# Altium project ESP32_P4_M3.PrjPcb
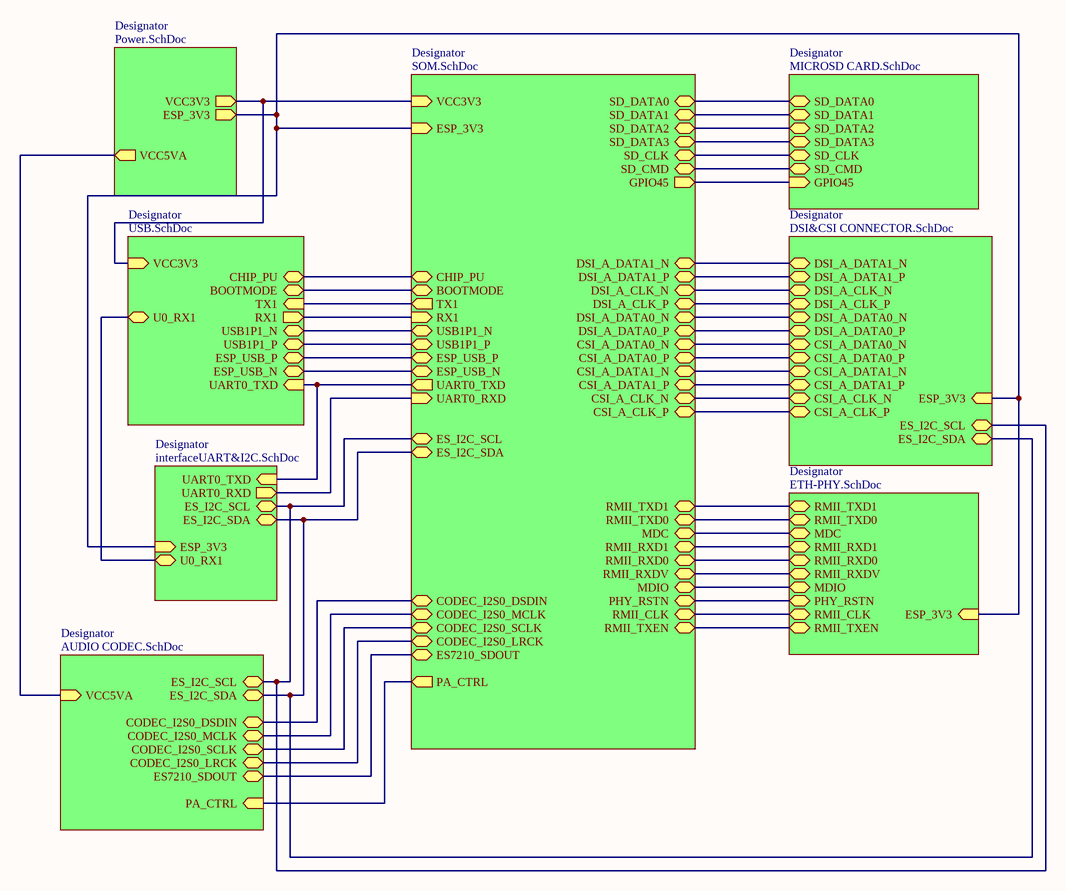
[diagram p0: Main.SchDoc]
9 sheets, 203 parts. Net scope: hierarchical (ports join the sheet entries above them; power ports are global).
Board file: ESP32P4 SOM.PcbDoc
Sheets:
  Main.SchDoc
    Designator = Power.SchDoc
    Designator = interfaceUART&I2C.SchDoc
    Designator = AUDIO CODEC.SchDoc
    Designator = MICROSD CARD.SchDoc
    Designator = USB.SchDoc
    Designator = DSI&CSI CONNECTOR.SchDoc
    Designator = ETH-PHY.SchDoc
    Designator = SOM.SchDoc

## Sheet Main.SchDoc
size A4; Author: Qquoc; CompanyName: VKU; DrawnBy: Qquoc; Address1: AN NHƠN-BÌNH ĐỊNH; Revision: V1.0; SheetNumber: 1; SheetTotal: 9

### Sub-sheets
Designator = Power.SchDoc: VCC3V3 (out), ESP_3V3 (out), VCC5VA (out)
Designator = interfaceUART&I2C.SchDoc: ESP_3V3 (in), UART0_TXD (in), UART0_RXD (out), ES_I2C_SCL (bidir), ES_I2C_SDA (bidir), U0_RX1 (bidir)
Designator = AUDIO CODEC.SchDoc: VCC5VA (in), PA_CTRL (in), CODEC_I2S0_SCLK (bidir), ES7210_SDOUT (bidir), CODEC_I2S0_LRCK (bidir), CODEC_I2S0_DSDIN (bidir), ES_I2C_SDA (bidir), ES_I2C_SCL (bidir), CODEC_I2S0_MCLK (bidir)
Designator = MICROSD CARD.SchDoc: GPIO45 (in), SD_DATA2 (bidir), SD_DATA3 (bidir), SD_CLK (bidir), SD_DATA0 (bidir), SD_DATA1 (bidir), SD_CMD (bidir)
Designator = USB.SchDoc: VCC3V3 (in), CHIP_PU (bidir), BOOTMODE (bidir), RX1 (out), TX1 (in), USB1P1_N (bidir), USB1P1_P (bidir), ESP_USB_P (bidir), ESP_USB_N (bidir), U0_RX1 (bidir), UART0_TXD (in)
Designator = DSI&CSI CONNECTOR.SchDoc: ES_I2C_SCL (bidir), ES_I2C_SDA (bidir), DSI_A_DATA1_N (bidir), DSI_A_DATA1_P (bidir), DSI_A_CLK_N (bidir), DSI_A_CLK_P (bidir), DSI_A_DATA0_N (bidir), DSI_A_DATA0_P (bidir), ESP_3V3 (in), CSI_A_DATA0_N (bidir), CSI_A_DATA0_P (bidir), CSI_A_DATA1_N (bidir), CSI_A_DATA1_P (bidir), CSI_A_CLK_N (bidir), CSI_A_CLK_P (bidir)
Designator = ETH-PHY.SchDoc: ESP_3V3 (in), RMII_TXEN (bidir), RMII_TXD0 (bidir), RMII_CLK (bidir), RMII_RXDV (bidir), RMII_RXD0 (bidir), RMII_RXD1 (bidir), MDC (bidir), PHY_RSTN (bidir), MDIO (bidir), RMII_TXD1 (bidir)
Designator = SOM.SchDoc: VCC3V3 (in), CHIP_PU (bidir), SD_DATA2 (bidir), SD_DATA3 (bidir), SD_CLK (bidir), SD_CMD (bidir), GPIO45 (out), SD_DATA1 (bidir), SD_DATA0 (bidir), UART0_RXD (in), UART0_TXD (out), BOOTMODE (bidir), RX1 (in), TX1 (out), USB1P1_P (bidir), USB1P1_N (bidir), ESP_USB_P (bidir), ESP_USB_N (bidir), CSI_A_DATA1_P (bidir), CSI_A_DATA1_N (bidir), CSI_A_CLK_N (bidir), CSI_A_CLK_P (bidir), CSI_A_DATA0_P (bidir), CSI_A_DATA0_N (bidir), DSI_A_DATA0_P (bidir), DSI_A_CLK_P (bidir), DSI_A_CLK_N (bidir), DSI_A_DATA1_P (bidir), DSI_A_DATA1_N (bidir), PA_CTRL (out), RMII_TXD1 (bidir), RMII_TXD0 (bidir), MDC (bidir), RMII_RXD1 (bidir), RMII_RXD0 (bidir), RMII_RXDV (bidir), MDIO (bidir), PHY_RSTN (bidir), RMII_CLK (bidir), RMII_TXEN (bidir), ES7210_SDOUT (bidir), CODEC_I2S0_DSDIN (bidir), CODEC_I2S0_MCLK (bidir), CODEC_I2S0_SCLK (bidir), CODEC_I2S0_LRCK (bidir), ES_I2C_SDA (bidir), ES_I2C_SCL (bidir), ESP_3V3 (in), DSI_A_DATA0_N (bidir)

### Nets
ESP_3V3: sheet Designator/ESP_3V3, sheet Designator/ESP_3V3, sheet Designator/ESP_3V3, sheet Designator/ESP_3V3, sheet Designator/ESP_3V3
VCC3V3: sheet Designator/VCC3V3, sheet Designator/VCC3V3, sheet Designator/VCC3V3
BOOTMODE: sheet Designator/BOOTMODE, sheet Designator/BOOTMODE
CHIP_PU: sheet Designator/CHIP_PU, sheet Designator/CHIP_PU
CODEC_I2S0_DSDIN: sheet Designator/CODEC_I2S0_DSDIN, sheet Designator/CODEC_I2S0_DSDIN
CODEC_I2S0_LRCK: sheet Designator/CODEC_I2S0_LRCK, sheet Designator/CODEC_I2S0_LRCK
CODEC_I2S0_MCLK: sheet Designator/CODEC_I2S0_MCLK, sheet Designator/CODEC_I2S0_MCLK
CODEC_I2S0_SCLK: sheet Designator/CODEC_I2S0_SCLK, sheet Designator/CODEC_I2S0_SCLK
CSI_A_CLK_N: sheet Designator/CSI_A_CLK_N, sheet Designator/CSI_A_CLK_N
CSI_A_CLK_P: sheet Designator/CSI_A_CLK_P, sheet Designator/CSI_A_CLK_P
CSI_A_DATA0_N: sheet Designator/CSI_A_DATA0_N, sheet Designator/CSI_A_DATA0_N
CSI_A_DATA0_P: sheet Designator/CSI_A_DATA0_P, sheet Designator/CSI_A_DATA0_P
CSI_A_DATA1_N: sheet Designator/CSI_A_DATA1_N, sheet Designator/CSI_A_DATA1_N
CSI_A_DATA1_P: sheet Designator/CSI_A_DATA1_P, sheet Designator/CSI_A_DATA1_P
DSI_A_CLK_N: sheet Designator/DSI_A_CLK_N, sheet Designator/DSI_A_CLK_N
DSI_A_CLK_P: sheet Designator/DSI_A_CLK_P, sheet Designator/DSI_A_CLK_P
DSI_A_DATA0_N: sheet Designator/DSI_A_DATA0_N, sheet Designator/DSI_A_DATA0_N
DSI_A_DATA0_P: sheet Designator/DSI_A_DATA0_P, sheet Designator/DSI_A_DATA0_P
DSI_A_DATA1_N: sheet Designator/DSI_A_DATA1_N, sheet Designator/DSI_A_DATA1_N
DSI_A_DATA1_P: sheet Designator/DSI_A_DATA1_P, sheet Designator/DSI_A_DATA1_P
ES7210_SDOUT: sheet Designator/ES7210_SDOUT, sheet Designator/ES7210_SDOUT
ES_I2C_SCL: sheet Designator/ES_I2C_SCL, sheet Designator/ES_I2C_SCL, sheet Designator/ES_I2C_SCL, sheet Designator/ES_I2C_SCL
ES_I2C_SDA: sheet Designator/ES_I2C_SDA, sheet Designator/ES_I2C_SDA, sheet Designator/ES_I2C_SDA, sheet Designator/ES_I2C_SDA
ESP_USB_N: sheet Designator/ESP_USB_N, sheet Designator/ESP_USB_N
ESP_USB_P: sheet Designator/ESP_USB_P, sheet Designator/ESP_USB_P
GPIO26: sheet Designator/TX1, sheet Designator/TX1
GPIO27: sheet Designator/RX1, sheet Designator/RX1
GPIO28: sheet Designator/RMII_RXDV, sheet Designator/RMII_RXDV
GPIO29: sheet Designator/RMII_RXD0, sheet Designator/RMII_RXD0
GPIO30: sheet Designator/RMII_RXD1, sheet Designator/RMII_RXD1
GPIO31: sheet Designator/MDC, sheet Designator/MDC
GPIO34: sheet Designator/RMII_TXD0, sheet Designator/RMII_TXD0
GPIO37: sheet Designator/UART0_TXD, sheet Designator/UART0_TXD, sheet Designator/UART0_TXD
GPIO38: sheet Designator/UART0_RXD, sheet Designator/UART0_RXD
GPIO45: sheet Designator/GPIO45, sheet Designator/GPIO45
GPIO50: sheet Designator/RMII_CLK, sheet Designator/RMII_CLK
GPIO51: sheet Designator/PHY_RSTN, sheet Designator/PHY_RSTN
GPIO52: sheet Designator/MDIO, sheet Designator/MDIO
RMII_TXD1: sheet Designator/RMII_TXD1, sheet Designator/RMII_TXD1
RMII_TXEN: sheet Designator/RMII_TXEN, sheet Designator/RMII_TXEN
SD_CLK: sheet Designator/SD_CLK, sheet Designator/SD_CLK
SD_CMD: sheet Designator/SD_CMD, sheet Designator/SD_CMD
SD_DATA0: sheet Designator/SD_DATA0, sheet Designator/SD_DATA0
SD_DATA1: sheet Designator/SD_DATA1, sheet Designator/SD_DATA1
SD_DATA2: sheet Designator/SD_DATA2, sheet Designator/SD_DATA2
SD_DATA3: sheet Designator/SD_DATA3, sheet Designator/SD_DATA3
U0_RX1: sheet Designator/U0_RX1, sheet Designator/U0_RX1
USB1P1_N: sheet Designator/USB1P1_N, sheet Designator/USB1P1_N
USB1P1_P: sheet Designator/USB1P1_P, sheet Designator/USB1P1_P
VCC5VA: sheet Designator/VCC5VA, sheet Designator/VCC5VA
NetIC2_1: sheet Designator/PA_CTRL, sheet Designator/PA_CTRL

## Sheet Power.SchDoc
size A4; SheetNumber: 5; SheetTotal: 9
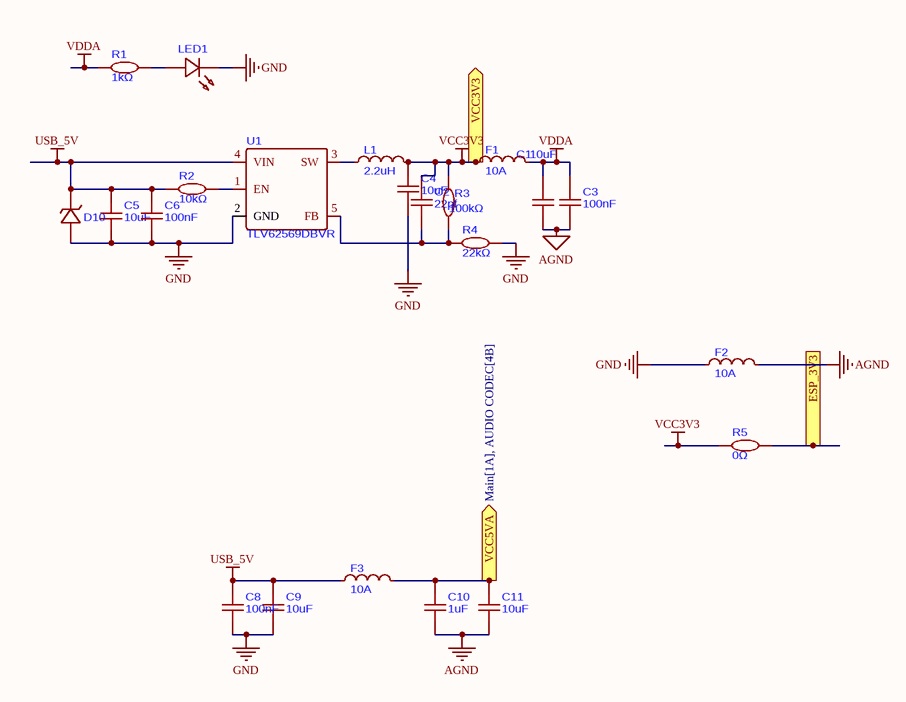
[diagram p1: Power.SchDoc]

### Parts
C1  10uF  [C0603]
C2  22pf  [C0603]
C3  100nF  [C0603]
C4  10uF  [C0603]
C5  10uF  [C0603]
C6  100nF  [C0603]
C8  100nF  [C0603]
C9  10uF  [C0603]
C10  1uF  [C0603]
C11  10uF  [C0603]
D10  DIODE ZENER 5.6V 500mW LL-34  [LL-34_L3.5-W1.5-RD]  (value not drawn)
F1  10A  [IND-SMD_L8.5-W3.1]
F2  10A  [IND-SMD_L8.5-W3.1]
F3  10A  [IND-SMD_L8.5-W3.1]
L1  2.2uH  [IND-SMD_L5.4-W5.2]
LED1  XL-1608SURC-06  [LED0603-RD_RED]  (value not drawn)
R1  1kΩ  [R0603]
R2  10kΩ  [R0603]
R3  100kΩ  [R0603]
R4  22kΩ  [R0603]
R5  0Ω  [R0603]
U1  TLV62569DBVR  [SOT-23-5_L3.0-W1.7-P0.95-LS2.8-BR]

### Ports
ESP_3V3 (out, see Main[2A], DSI&CSI CONNECTOR[3C], ETH-PHY[2A], interfaceUART&I2C[1C], SOM[6B]), VCC3V3 (out, see Main[2A], SOM[4A], USB[4C]), VCC5VA (out, see Main[1A], AUDIO CODEC[4B])

### Nets
AGND: C1.1 C3.1 C10.2 C11.1 F2.2
ESP_3V3: R5.2 ; port ESP_3V3
GND: C4.1 C5.1 C6.1 C8.1 C9.1 D10.2(A) F2.1 LED1.1(K) R4.2 U1.2(GND)
USB_5V: C5.2 C6.2 C8.2 C9.2 D10.1(K) F3.1 R2.1 U1.4(VIN)
VCC3V3: C2.2 C4.2 F1.1 L1.2 R3.2 R5.1 ; port VCC3V3
VDDA: C1.2 C3.2 F1.2 R1.2
VCC5VA: C10.1 C11.2 F3.2 ; port VCC5VA
NetC2_1: C2.1 R3.1 R4.1 U1.5(FB)
NetL1_1: L1.1 U1.3(SW)
NetLED1_2: LED1.2(A) R1.1
NetR2_2: R2.2 U1.1(EN)

### Library data of the parts
C1 C4 C5 C9 C11 = CL10A106MA8NRNC: 25V 10uF X5R ±20% 0603 Ceramic Capacitors ROHS
C2 = CL10C220JB8NNNC: 50V 22pF C0G ±5% 0603 Ceramic Capacitors RoHS
C3 C6 C8 = CC0603KRX7R9BB104: 50V 100nF X7R ±10% 0603 Ceramic Capacitors ROHS
C10 = CL10B105KA8NNNC: 25V 1uF X7R ±10% 0603 Ceramic Capacitors ROHS
D10 = ZMM5V6_C707195: Zener Diode Independent 5.6V 500mW Surface Mount LL-34
F1-F3 = HI3312X101R-10: 4mΩ 100Ω@100MHz SMD,8.5x3.1mm Ferrite Beads and Chips ROHS
L1 = APH0530T2R2M: 7A 2.2uH Molded Inductor ±20% 7A 29mΩ SMD,5.4x5.2mm Fixed Inductors RoHS
LED1 = XL-1608SURC-06: 20mA 2.3V Red 50mW 0603 LED Indication - Discrete ROHS
R1 = RMC 0603 1K J N: 100mW 1kΩ 50V ±100ppm/℃ Thick Film Resistor ±5% 0603 Chip Resistor - Surface Mount ROHS
R2 = RC0603FR-0710KL: 100mW 10kΩ 75V ±100ppm/℃ Thick Film Resistor ±1% 0603 Chip Resistor - Surface Mount ROHS
R3 = RC0603FR-07100KL: 100mW 100kΩ 75V ±100ppm/℃ Thick Film Resistor ±1% 0603 Chip Resistor - Surface Mount ROHS
R4 = RC0603FR-0722KL: 100mW 22kΩ 75V ±100ppm/℃ Thick Film Resistor ±1% 0603 Chip Resistor - Surface Mount RoHS
R5 = RC0603JR-070RL: 100mW 0Ω 75V Thick Film Resistor ±5% 0603 Chip Resistor - Surface Mount RoHS
U1 = TLV62569DBVR: 1.5MHz 2A Buck Adjustable 600mV~5.5V 1 SOT-23-5 Voltage Regulators - DC DC Switching Regulators RoHS

## Sheet interfaceUART&I2C.SchDoc
size A; SheetNumber: 3; SheetTotal: 9
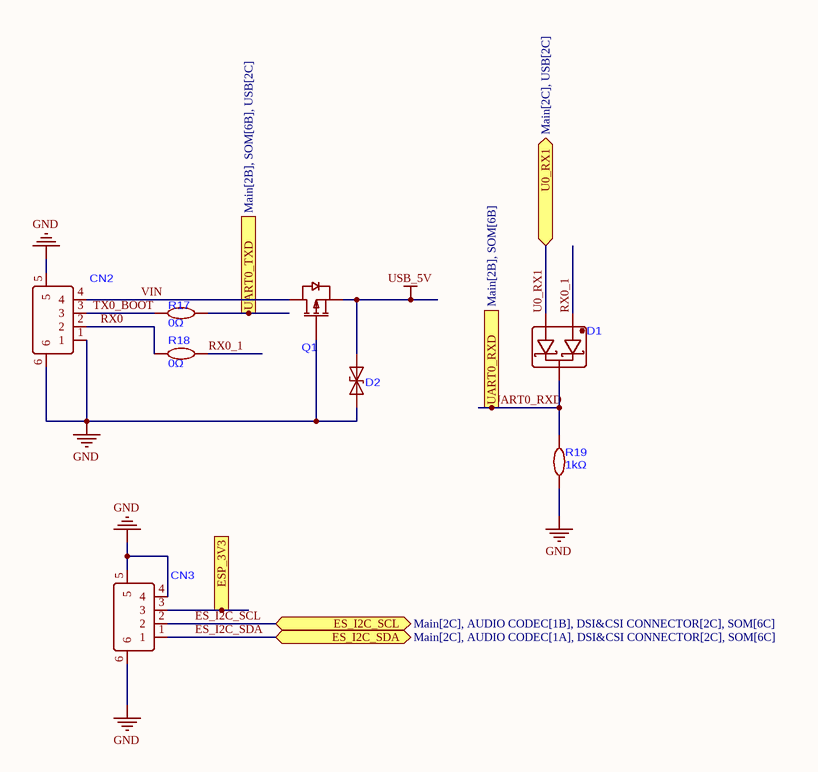
[diagram p2: interfaceUART&I2C.SchDoc]

### Parts
CN2  533980471  [CONN-SMD_4P-P1.25_XUNPU_WAFER-GH1.25-4PWB]  (value not drawn)
CN3  533980471  [CONN-SMD_4P-P1.25_XUNPU_WAFER-GH1.25-4PWB]  (value not drawn)
D1  DIODE ARR SCHOTTKY 30V SOT-23  [SOT-23-3_L2.9-W1.3-P1.90-LS2.4-BR]  (value not drawn)
D2  TVS DIODE 5VWM 18.6VC SOD-523  [SOD-523_L1.2-W0.8-LS1.6-BI]  (value not drawn)
Q1  MOSFET P-CH 30V 4.3A SOT-23  [2SOT-23-3_L2.9-W1.6-P1.90-LS2.8-BR]  (value not drawn)
R17  0Ω  [R0603]
R18  0Ω  [R0603]
R19  1kΩ  [R0603]

### Ports
ES_I2C_SCL (bidir, see Main[2C], AUDIO CODEC[1B], DSI&CSI CONNECTOR[2C], SOM[6C]), ES_I2C_SDA (bidir, see Main[2C], AUDIO CODEC[1A], DSI&CSI CONNECTOR[2C], SOM[6C]), ESP_3V3 (in, see Main[2C], DSI&CSI CONNECTOR[3C], ETH-PHY[2A], Power[3C], SOM[6B]), U0_RX1 (bidir, see Main[2C], USB[2C]), UART0_RXD (out, see Main[2B], SOM[6B]), UART0_TXD (in, see Main[2B], SOM[6B], USB[2C])

### Nets
ESP_3V3: CN3.3 ; port ESP_3V3
GND: CN2.1 CN2.5 CN2.6 CN3.4 CN3.5 CN3.6 D2.1(K) Q1.1(G) R19.1
USB_5V: D2.2(A) Q1.2(S)
ES_I2C_SCL: CN3.2 ; port ES_I2C_SCL
ES_I2C_SDA: CN3.1 ; port ES_I2C_SDA
GPIO37: R17.2 ; port UART0_TXD
RX0: CN2.2 R18.1
RX0_1: D1.1 R18.2
TX0_BOOT: CN2.3 R17.1
U0_RX1: D1.2 ; port U0_RX1
UART0_RXD: D1.3 R19.2 ; port UART0_RXD  [project net GPIO38]
VIN: CN2.4 Q1.3(D)

### Library data of the parts
CN2 CN3 = 533980471: 4P PicoBlade(MX 1.25) 1x4P Tin -40℃~+105℃ White 1.25mm 125V 4 1A 1 Surface Mount,Vertical SMD,P=1.25mm Headers, Male Pins RoHS
D1 = BAT54C_C916424: 600mA 30V 1 Pair Common Cathode 1V@100mA 200mA SOT-23 Single Diodes RoHS
D2 = LESD5D5.0CT1G: 9.4A@8/20us 18.6V 7.8V 5V SOD-523 TVS Diodes RoHS
Q1 = AO3407A: 30V 4.3A 48mΩ@10V 2.5V@250uA 1 P-Channel SOT-23 Single FETs, MOSFETs ROHS
R17 R18 = RC0603JR-070RL: as R5 on sheet Power
R19 = RMC 0603 1K J N: as R1 on sheet Power

## Sheet AUDIO CODEC.SchDoc
size A4; SheetNumber: 2; SheetTotal: 9
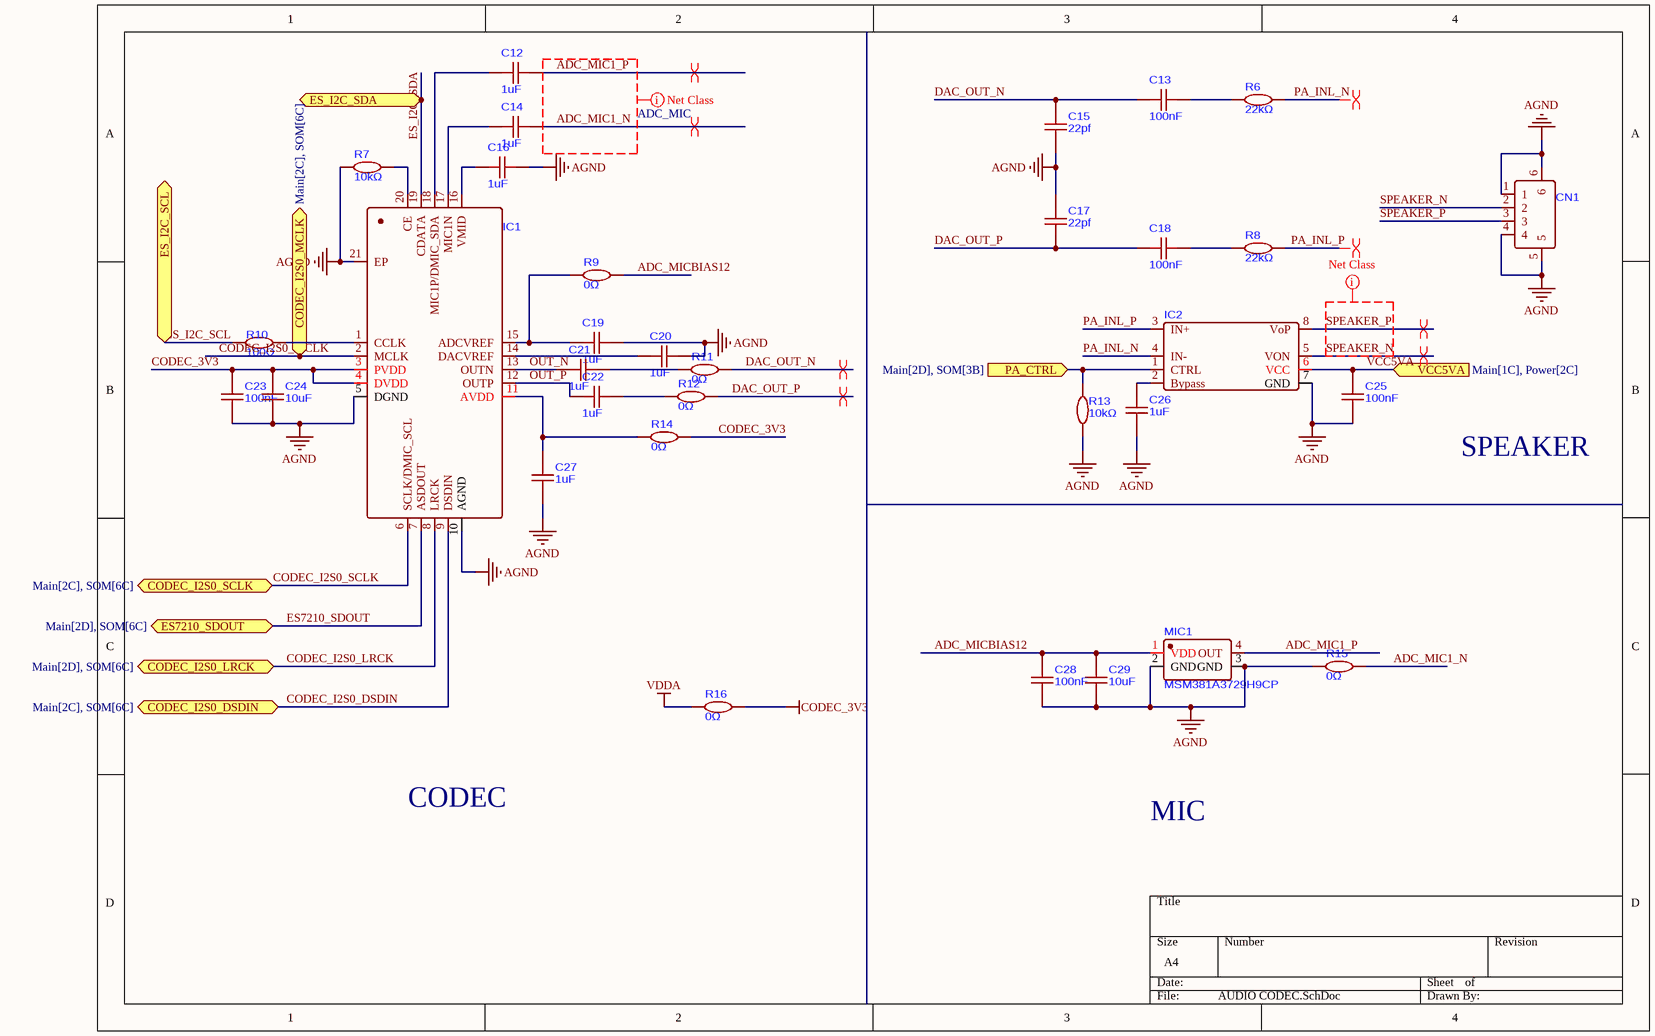
[diagram p3: AUDIO CODEC.SchDoc]

### Parts
C12  1uF  [C0603]
C13  100nF  [C0603]
C14  1uF  [C0603]
C15  22pf  [C0603]
C16  1uF  [C0603]
C17  22pf  [C0603]
C18  100nF  [C0603]
C19  1uF  [C0603]
C20  1uF  [C0603]
C21  1uF  [C0603]
C22  1uF  [C0603]
C23  100nF  [C0603]
C24  10uF  [C0603]
C25  100nF  [C0603]
C26  1uF  [C0603]
C27  1uF  [C0603]
C28  100nF  [C0603]
C29  10uF  [C0603]
CN1  533980471  [CONN-SMD_4P-P1.25_XUNPU_WAFER-GH1.25-4PWB]  (value not drawn)
IC1  Low Power Mono Audio CODEC  [WQFN-20_L3.0-W3.0-P0.40-BL-EP1.7]  (value not drawn)
IC2  NS4150B 3.0W Mono Class-D Audio Power Amplifier  [MSOP-8_L3.0-W3.0-P0.65-LS5.0-BL]  (value not drawn)
MIC1  MSM381A3729H9CP  [MIC-SMD_4P-L3.8-W3.0-P2.46-S1.70-TR]
R6  22kΩ  [R0603]
R7  10kΩ  [R0603]
R8  22kΩ  [R0603]
R9  0Ω  [R0603]
R10  100Ω  [R0603]
R11  0Ω  [R0603]
R12  0Ω  [R0603]
R13  10kΩ  [R0603]
R14  0Ω  [R0603]
R15  0Ω  [R0603]
R16  0Ω  [R0603]

### Ports
CODEC_I2S0_DSDIN (bidir, see Main[2C], SOM[6C]), CODEC_I2S0_LRCK (bidir, see Main[2D], SOM[6C]), CODEC_I2S0_MCLK (bidir, see Main[2C], SOM[6C]), CODEC_I2S0_SCLK (bidir, see Main[2C], SOM[6C]), ES7210_SDOUT (bidir, see Main[2D], SOM[6C]), ES_I2C_SCL (bidir, see Main[2C], DSI&CSI CONNECTOR[2C], interfaceUART&I2C[2C], SOM[6C]), ES_I2C_SDA (bidir, see Main[2C], DSI&CSI CONNECTOR[2C], interfaceUART&I2C[2C], SOM[6C]), PA_CTRL (in, see Main[2D], SOM[3B]), VCC5VA (in, see Main[1C], Power[2C])

### Nets
AGND: C15.1 C16.1 C17.2 C19.1 C20.1 C23.1 C24.1 C25.1 C26.1 C27.2 C28.1 C29.1 CN1.1 CN1.4 CN1.5 CN1.6 IC1.5(DGND) IC1.10(AGND) IC1.21(EP) IC2.7(GND) MIC1.2(GND) MIC1.3(GND) R7.1 R13.1 R15.1
CODEC_3V3: C23.2 C24.2 IC1.3(PVDD) IC1.4(DVDD) R14.2 R16.2
VDDA: R16.1
ADC_MIC1_N: C14.1 R15.2
ADC_MIC1_P: C12.2 MIC1.4(OUT)
ADC_MICBIAS12: C28.2 C29.2 MIC1.1(VDD) R9.2
CODEC_I2S0_DSDIN: IC1.9(DSDIN) ; port CODEC_I2S0_DSDIN
CODEC_I2S0_LRCK: IC1.8(LRCK) ; port CODEC_I2S0_LRCK
CODEC_I2S0_MCLK: IC1.2(MCLK) ; port CODEC_I2S0_MCLK
CODEC_I2S0_SCLK: IC1.6(SCLK/DMIC_SCL) ; port CODEC_I2S0_SCLK
DAC_OUT_N: C13.1 C15.2 R11.2
DAC_OUT_P: C17.1 C18.1 R12.2
ES7210_SDOUT: IC1.7(ASDOUT) ; port ES7210_SDOUT
ES_I2C_SCL: R10.1 ; port ES_I2C_SCL
ES_I2C_SDA: IC1.19(CDATA) ; port ES_I2C_SDA
OUT_N: C21.2 IC1.13(OUTN)
OUT_P: C22.2 IC1.12(OUTP)
PA_INL_N: IC2.4(IN-) R6.2
PA_INL_P: IC2.3(IN+) R8.2
SPEAKER_N: CN1.2 IC2.5(VON)
SPEAKER_P: CN1.3 IC2.8(VoP)
VCC5VA: C25.2 IC2.6(VCC) ; port VCC5VA
NetC12_1: C12.1 IC1.18(MIC1P/DMIC_SDA)
NetC13_2: C13.2 R6.1
NetC14_2: C14.2 IC1.17(MIC1N)
NetC16_2: C16.2 IC1.16(VMID)
NetC18_2: C18.2 R8.1
NetC19_2: C19.2 IC1.15(ADCVREF) R9.1
NetC20_2: C20.2 IC1.14(DACVREF)
NetC21_1: C21.1 R11.1
NetC22_1: C22.1 R12.1
NetC26_2: C26.2 IC2.2(Bypass)
NetC27_1: C27.1 IC1.11(AVDD) R14.1
NetIC1_1: IC1.1(CCLK) R10.2
NetIC1_20: IC1.20(CE) R7.2
NetIC2_1: IC2.1(CTRL) R13.2 ; port PA_CTRL

### Layout directives
net class ADC_MIC: ADC_MIC1_N, ADC_MIC1_P
differential pair; net class DIFF; differential pair class DIFF: ADC_MIC1_N, ADC_MIC1_P, DAC_OUT_N, DAC_OUT_P, PA_INL_N, PA_INL_P, SPEAKER_N, SPEAKER_P
net class SPEAKER: SPEAKER_N, SPEAKER_P

### Notes on the sheet
- SPEAKER
- CODEC
- MIC

### Library data of the parts
C12 C14 C16 C19-C22 C26 C27 = CL10B105KA8NNNC: as C10 on sheet Power
C13 C18 C23 C25 C28 = CC0603KRX7R9BB104: as C3 on sheet Power
C15 C17 = CL10C220JB8NNNC: as C2 on sheet Power
C24 C29 = CL10A106MA8NRNC: as C1 on sheet Power
CN1 = 533980471: as CN2 on sheet interfaceUART&I2C
IC1 = ES8311: 1.8V~3.3V QFN-20-EP(3x3) Signal Switches, Multiplexers, Decoders RoHS
IC2 = NS4150: 4mA 1-Channel 3Wx1@4Ω Class D MSOP-8 Audio Amplifiers RoHS
MIC1 = MSM381A3729H9CP: OCLGA-4(3x3.8) MEMS Microphones ROHS
R6 R8 = RC0603FR-0722KL: as R4 on sheet Power
R7 R13 = RC0603FR-0710KL: as R2 on sheet Power
R9 R11 R12 R14-R16 = RC0603JR-070RL: as R5 on sheet Power
R10 = RC0603FR-07100RL: 100mW 100Ω 75V ±100ppm/℃ Thick Film Resistor ±1% 0603 Chip Resistor - Surface Mount ROHS

## Sheet MICROSD CARD.SchDoc
size A4; SheetNumber: 4; SheetTotal: 9
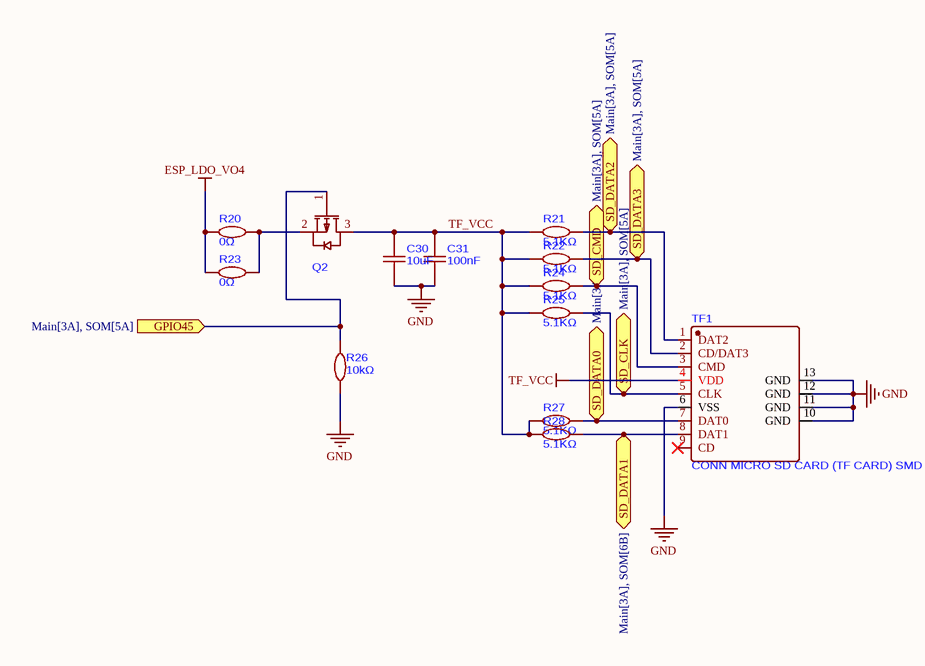
[diagram p4: MICROSD CARD.SchDoc]

### Parts
C30  10uF  [C0603]
C31  100nF  [C0603]
Q2  MOSFET P-CH 30V 4.3A SOT-23  [SOT-23-3_L2.9-W1.6-P1.90-LS2.8-BR]  (value not drawn)
R20  0Ω  [R0603]
R21  5.1KΩ  [R0603]
R22  5.1KΩ  [R0603]
R23  0Ω  [R0603]
R24  5.1KΩ  [R0603]
R25  5.1KΩ  [R0603]
R26  10kΩ  [R0603]
R27  5.1KΩ  [R0603]
R28  5.1KΩ  [R0603]
TF1  CONN MICRO SD CARD (TF CARD) SMD  [TF-SMD_SH_SH-TF-01B]

### Ports
GPIO45 (in, see Main[3A], SOM[5A]), SD_CLK (bidir, see Main[3A], SOM[5A]), SD_CMD (bidir, see Main[3A], SOM[5A]), SD_DATA0 (bidir, see Main[3A], SOM[6B]), SD_DATA1 (bidir, see Main[3A], SOM[6B]), SD_DATA2 (bidir, see Main[3A], SOM[5A]), SD_DATA3 (bidir, see Main[3A], SOM[5A])

### Nets
ESP_LDO_VO4: R20.1 R23.1
GND: C30.1 C31.1 R26.1 TF1.6(VSS) TF1.10(GND) TF1.11(GND) TF1.12(GND) TF1.13(GND)
TF_VCC: C30.2 C31.2 Q2.3(D) R21.1 R22.1 R24.1 R25.1 R27.1 R28.1 TF1.4(VDD)
GPIO45: Q2.1(G) R26.2 ; port GPIO45
SD_CLK: R25.2 TF1.5(CLK) ; port SD_CLK
SD_CMD: R24.2 TF1.3(CMD) ; port SD_CMD
SD_DATA0: R27.2 TF1.7(DAT0) ; port SD_DATA0
SD_DATA1: R28.2 TF1.8(DAT1) ; port SD_DATA1
SD_DATA2: R21.2 TF1.1(DAT2) ; port SD_DATA2
SD_DATA3: R22.2 TF1.2(CD/DAT3) ; port SD_DATA3
NetQ2_2: Q2.2(S) R20.2 R23.2

Not connected (* = marked no-connect by the designer): TF1 9(CD)*

### Library data of the parts
C30 = CL10A106MA8NRNC: as C1 on sheet Power
C31 = CC0603KRX7R9BB104: as C3 on sheet Power
Q2 = AO3407A: as Q1 on sheet interfaceUART&I2C
R20 R23 = RC0603JR-070RL: as R5 on sheet Power
R21 R22 R24 R25 R27 R28 = FRC0603F5101TS: 100mW 5.1kΩ 75V ±100ppm/℃ Thick Film Resistor ±1% 0603 Chip Resistor - Surface Mount RoHS
R26 = RC0603FR-0710KL: as R2 on sheet Power
TF1 = SH-TF-01A: -25℃~+85℃ Push-Push 2mm Connector and Ejector MicroSD Card (TF Card) SMD PC Card Sockets RoHS

## Sheet USB.SchDoc
size A3; SheetNumber: 6; SheetTotal: 9
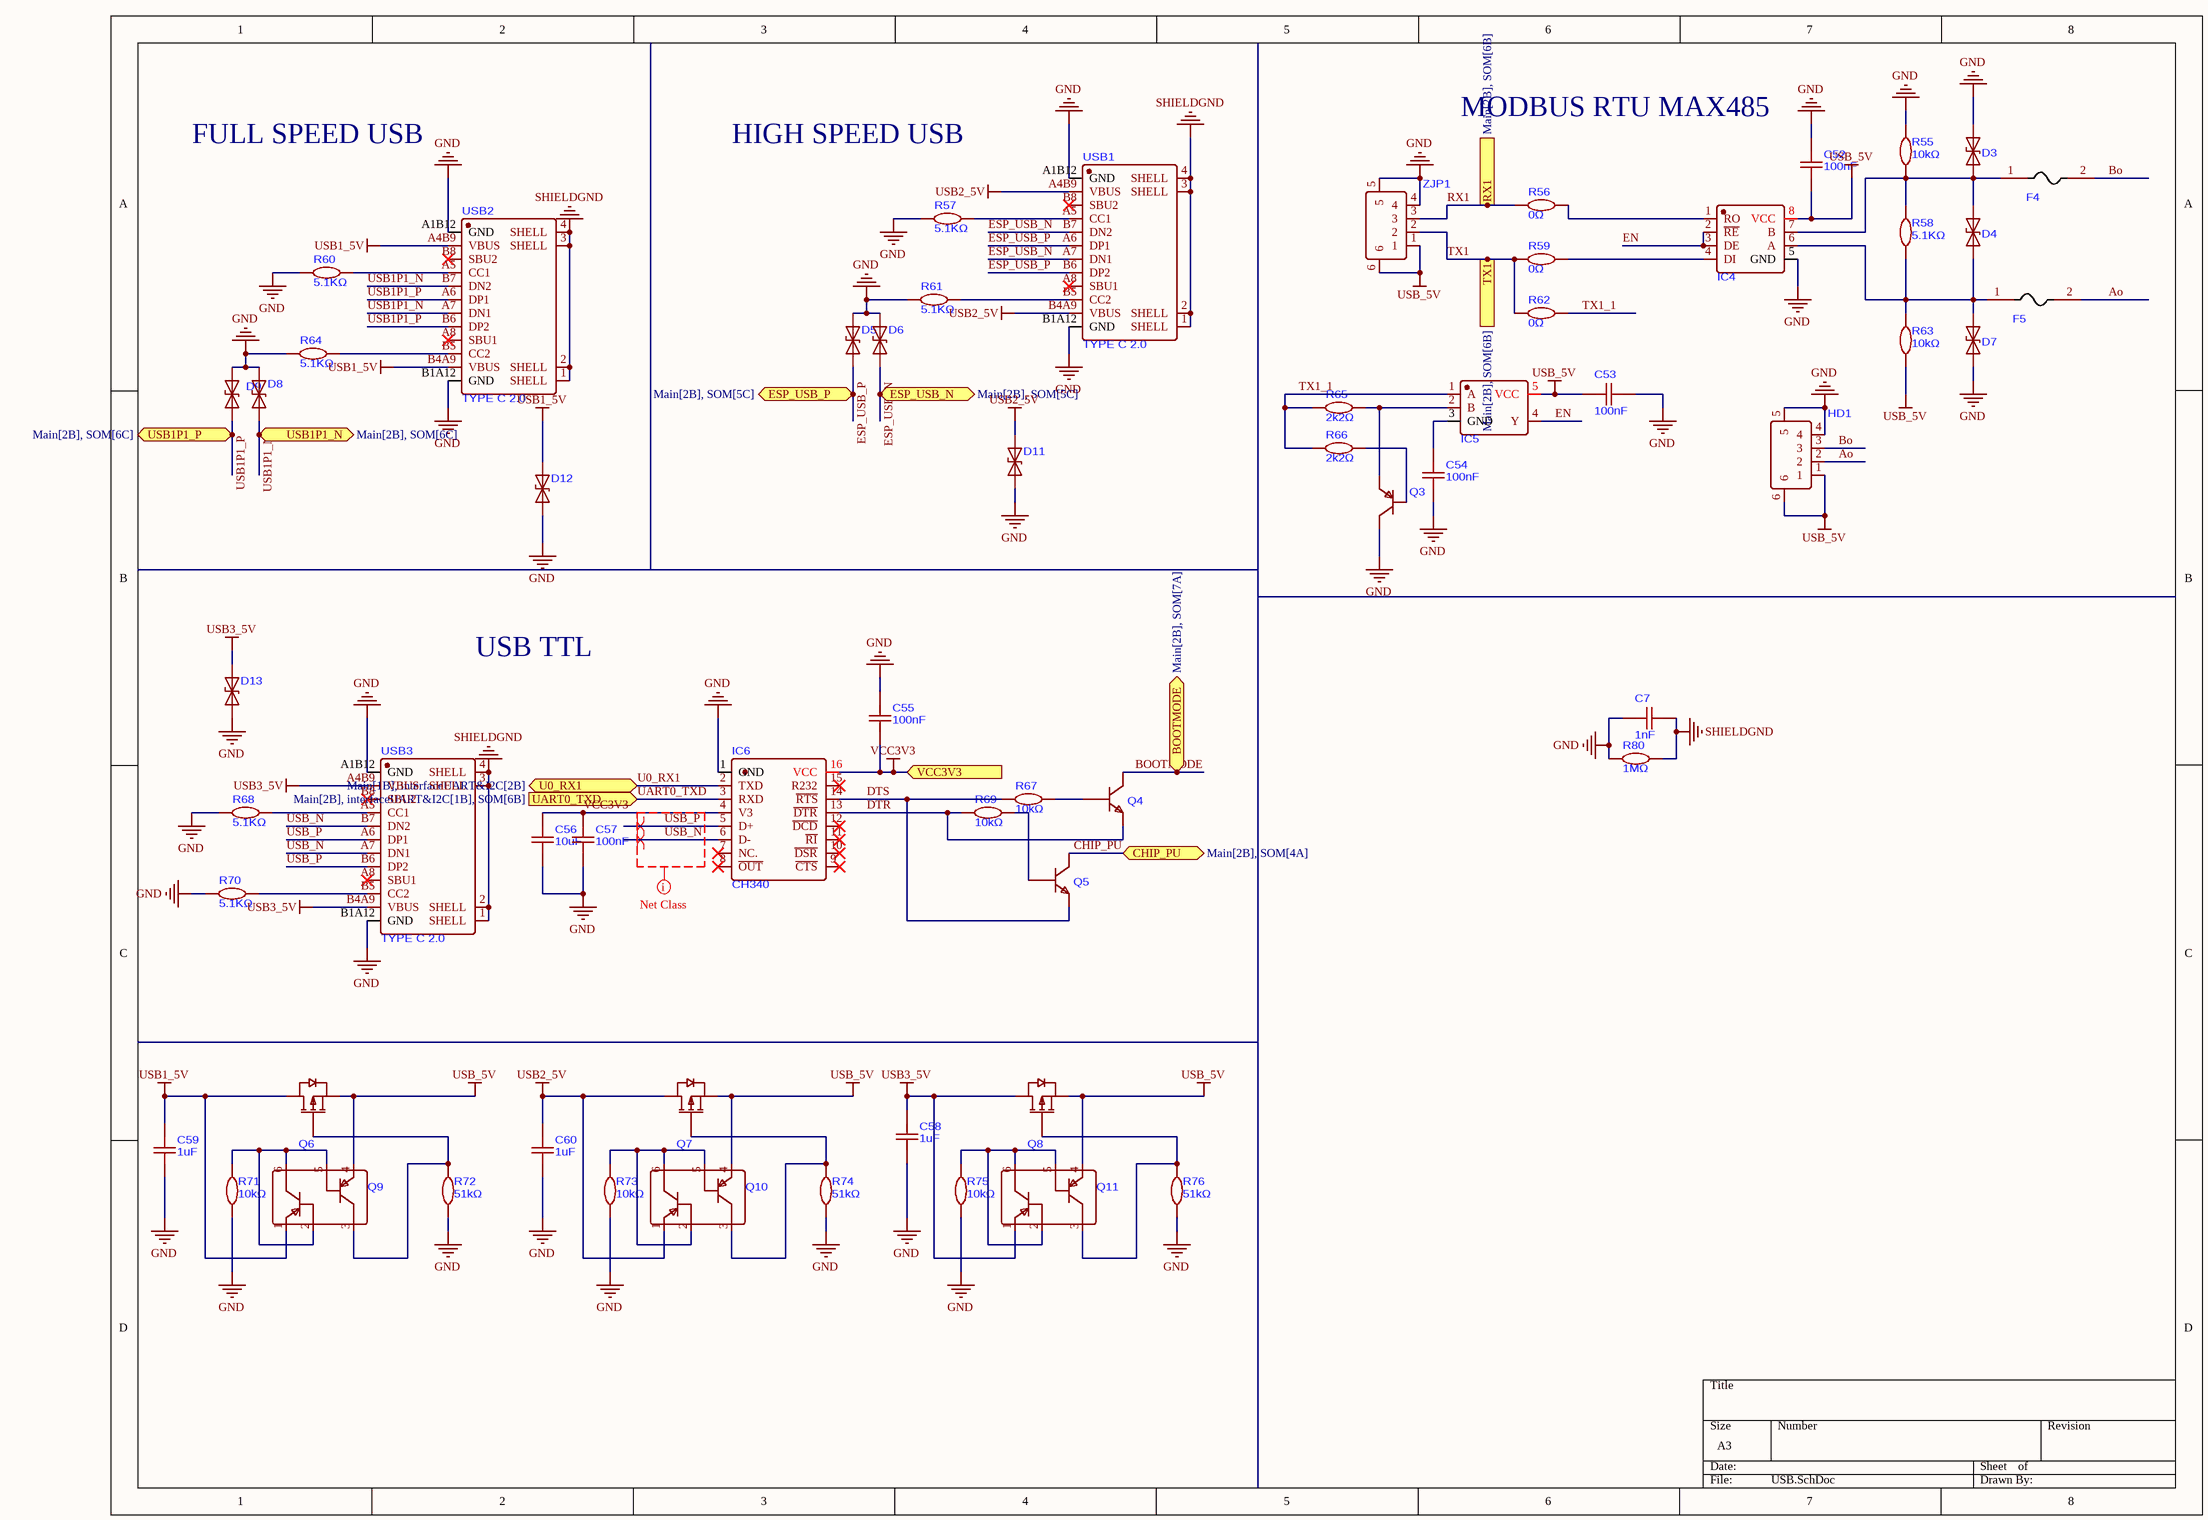
[diagram p5: USB.SchDoc]

### Parts
C7  1nF  [C1808]
C52  100nF  [C0603]
C53  100nF  [C0603]
C54  100nF  [C0603]
C55  100nF  [C0603]
C56  10uF  [C0603]
C57  100nF  [C0603]
C58  1uF  [C0603]
C59  1uF  [C0603]
C60  1uF  [C0603]
D3  TVS DIODE 5VWM 18.6VC SOD-523  [SOD-523_L1.2-W0.8-LS1.6-BI]  (value not drawn)
D4  TVS DIODE 5VWM 18.6VC SOD-523  [SOD-523_L1.2-W0.8-LS1.6-BI]  (value not drawn)
D5  TVS DIODE 5VWM 18.6VC SOD-523  [SOD-523_L1.2-W0.8-LS1.6-BI]  (value not drawn)
D6  TVS DIODE 5VWM 18.6VC SOD-523  [SOD-523_L1.2-W0.8-LS1.6-BI]  (value not drawn)
D7  TVS DIODE 5VWM 18.6VC SOD-523  [SOD-523_L1.2-W0.8-LS1.6-BI]  (value not drawn)
D8  TVS DIODE 5VWM 18.6VC SOD-523  [SOD-523_L1.2-W0.8-LS1.6-BI]  (value not drawn)
D9  TVS DIODE 5VWM 18.6VC SOD-523  [SOD-523_L1.2-W0.8-LS1.6-BI]  (value not drawn)
D11  TVS DIODE 5VWM 18.6VC SOD-523  [SOD-523_L1.2-W0.8-LS1.6-BI]  (value not drawn)
D12  TVS DIODE 5VWM 18.6VC SOD-523  [SOD-523_L1.2-W0.8-LS1.6-BI]  (value not drawn)
D13  TVS DIODE 5VWM 18.6VC SOD-523  [SOD-523_L1.2-W0.8-LS1.6-BI]  (value not drawn)
F4  PTC RESET FUSE 24V 100mA 0603  [F0603]  (value not drawn)
F5  PTC RESET FUSE 24V 100mA 0603  [F0603]  (value not drawn)
HD1  533980471  [CONN-SMD_4P-P1.25_XUNPU_WAFER-GH1.25-4PWB]  (value not drawn)
IC4  Low-Power, Slew-Rate-Limited RS-485/RS-422 Transceivers  [SOP-8_L4.9-W3.9-P1.27-LS6.0-BL]  (value not drawn)
IC5  SINGLE 2-INPUT NAND GATE WITH SCHMITT-TRIGGER INPUTS  [SOT-23-5_L3.0-W1.7-P0.95-LS2.8-BL]  (value not drawn)
IC6  CH340  [SOP-16_L10.0-W3.9-P1.27-LS6.0-BL]
Q3  TRANS PNP 25V 1.5A SOT-23  [SOT-23-3_L2.9-W1.3-P1.90-LS2.4-BR]  (value not drawn)
Q4  TRANS NPN 25V 0.5A SOT-23  [SOT-23-3_L2.9-W1.3-P1.90-LS2.4-BR]  (value not drawn)
Q5  TRANS NPN 25V 0.5A SOT-23  [SOT-23-3_L2.9-W1.3-P1.90-LS2.4-BR]  (value not drawn)
Q6  MOSFET P-CH 30V 4.3A SOT-23  [2SOT-23-3_L2.9-W1.6-P1.90-LS2.8-BR]  (value not drawn)
Q7  MOSFET P-CH 30V 4.3A SOT-23  [2SOT-23-3_L2.9-W1.6-P1.90-LS2.8-BR]  (value not drawn)
Q8  MOSFET P-CH 30V 4.3A SOT-23  [2SOT-23-3_L2.9-W1.6-P1.90-LS2.8-BR]  (value not drawn)
Q9  TRANS PNP 40V 200mA SOT-363  [SC-70-6_L2.2-W1.3-P0.65-LS2.1-TL]  (value not drawn)
Q10  TRANS PNP 40V 200mA SOT-363  [SC-70-6_L2.2-W1.3-P0.65-LS2.1-TL]  (value not drawn)
Q11  TRANS PNP 40V 200mA SOT-363  [SC-70-6_L2.2-W1.3-P0.65-LS2.1-TL]  (value not drawn)
R55  10kΩ  [R0603]
R56  0Ω  [R0603]
R57  5.1KΩ  [R0603]
R58  5.1KΩ  [R0603]
R59  0Ω  [R0603]
R60  5.1KΩ  [R0603]
R61  5.1KΩ  [R0603]
R62  0Ω  [R0603]
R63  10kΩ  [R0603]
R64  5.1KΩ  [R0603]
R65  2k2Ω  [R0603]
R66  2k2Ω  [R0603]
R67  10kΩ  [R0603]
R68  5.1KΩ  [R0603]
R69  10kΩ  [R0603]
R70  5.1KΩ  [R0603]
R71  10kΩ  [R0603]
R72  51kΩ  [R0603]
R73  10kΩ  [R0603]
R74  51kΩ  [R0603]
R75  10kΩ  [R0603]
R76  51kΩ  [R0603]
R80  1MΩ  [R2010]
USB1  TYPE C 2.0  [USB-C-SMD_G-SWITCH_GT-USB-7010ASV]
USB2  TYPE C 2.0  [USB-C-SMD_G-SWITCH_GT-USB-7010ASV]
USB3  TYPE C 2.0  [USB-C-SMD_G-SWITCH_GT-USB-7010ASV]
ZJP1  533980471  [CONN-SMD_4P-P1.25_XUNPU_WAFER-GH1.25-4PWB]  (value not drawn)

### Ports
BOOTMODE (bidir, see Main[2B], SOM[7A]), CHIP_PU (bidir, see Main[2B], SOM[4A]), ESP_USB_N (bidir, see Main[2B], SOM[5C]), ESP_USB_P (bidir, see Main[2B], SOM[5C]), RX1 (out, see Main[2B], SOM[6B]), TX1 (in, see Main[2B], SOM[6B]), U0_RX1 (bidir, see Main[1B], interfaceUART&I2C[2B]), UART0_TXD (in, see Main[2B], interfaceUART&I2C[1B], SOM[6B]), USB1P1_N (bidir, see Main[2B], SOM[6C]), USB1P1_P (bidir, see Main[2B], SOM[6C]), VCC3V3 (in, see Main[1B], Power[2B], SOM[4A])

### Nets
GND: C7.1 C52.2 C53.1 C54.1 C55.2 C56.1 C57.1 C58.1 C59.1 C60.1 D3.2(A) D5.2(A) D6.2(A) D7.1(K) D8.2(A) D9.2(A) D11.1(K) D12.1(K) D13.1(K) HD1.4 HD1.5 IC4.5(GND) IC6.1(GND) Q3.3(C) R55.2 R57.1 R60.1 R61.1 R64.1 R68.1 R70.1 R71.1 R72.1 R73.1 R74.1 R75.1 R76.1 R80.1 USB1.A1B12(GND) USB1.B1A12(GND) USB2.A1B12(GND) USB2.B1A12(GND) USB3.A1B12(GND) USB3.B1A12(GND) ZJP1.4 ZJP1.5
SHIELDGND: C7.2 R80.2 USB1.1(SHELL) USB1.2(SHELL) USB1.3(SHELL) USB1.4(SHELL) USB2.1(SHELL) USB2.2(SHELL) USB2.3(SHELL) USB2.4(SHELL) USB3.1(SHELL) USB3.2(SHELL) USB3.3(SHELL) USB3.4(SHELL)
USB1_5V: C59.2 D12.2(A) Q6.3(D) Q9.1(E2) USB2.A4B9(VBUS) USB2.B4A9(VBUS)
USB2_5V: C60.2 D11.2(A) Q7.3(D) Q10.1(E2) USB1.A4B9(VBUS) USB1.B4A9(VBUS)
USB3_5V: C58.2 D13.2(A) Q8.3(D) Q11.1(E2) USB3.A4B9(VBUS) USB3.B4A9(VBUS)
USB_5V: C52.1 C53.2 HD1.1 HD1.6 IC4.8(VCC) IC5.5(VCC) Q6.2(S) Q7.2(S) Q8.2(S) Q9.4(E1) Q10.4(E1) Q11.4(E1) R63.1 ZJP1.1 ZJP1.6
VCC3V3: C55.1 C56.2 C57.2 IC6.4(V3) IC6.16(VCC) ; port VCC3V3
Ao: F5.2 HD1.2
Bo: F4.2 HD1.3
BOOTMODE: Q4.3(C) ; port BOOTMODE
CHIP_PU: Q5.3(C) ; port CHIP_PU
DTR: IC6.13(~{DTR}) Q4.2(E) R69.1
DTS: IC6.14(~{RTS}) Q5.2(E) R67.1
EN: IC4.2(~{RE}) IC4.3(DE) IC5.4(Y)
ESP_USB_N: D6.1(K) USB1.A7(DN1) USB1.B7(DN2) ; port ESP_USB_N
ESP_USB_P: D5.1(K) USB1.A6(DP1) USB1.B6(DP2) ; port ESP_USB_P
RX1: R56.1 ZJP1.3 ; port RX1  [project net GPIO27]
TX1: R59.1 R62.1 ZJP1.2 ; port TX1  [project net GPIO26]
TX1_1: IC5.1(A) R62.2 R65.2 R66.1
U0_RX1: IC6.2(TXD) ; port U0_RX1
UART0_TXD: IC6.3(RXD) ; port UART0_TXD  [project net GPIO37]
USB1P1_N: D8.1(K) USB2.A7(DN1) USB2.B7(DN2) ; port USB1P1_N
USB1P1_P: D9.1(K) USB2.A6(DP1) USB2.B6(DP2) ; port USB1P1_P
USB_N: IC6.6(D-) USB3.A7(DN1) USB3.B7(DN2)
USB_P: IC6.5(D+) USB3.A6(DP1) USB3.B6(DP2)
NetC54_2: C54.2 IC5.3(GND)
NetD3_1: D3.1(K) D4.2(A) F4.1 IC4.7(B) R55.1 R58.2
NetD4_1: D4.1(K) D7.2(A) F5.1 IC4.6(A) R58.1 R63.2
NetIC4_1: IC4.1(RO) R56.2
NetIC4_4: IC4.4(DI) R59.2
NetIC5_2: IC5.2(B) Q3.2(E) R65.1
NetQ3_1: Q3.1(B) R66.2
NetQ4_1: Q4.1(B) R67.2
NetQ5_1: Q5.1(B) R69.2
NetQ6_1: Q6.1(G) Q9.3(C1) R72.2
NetQ7_1: Q7.1(G) Q10.3(C1) R74.2
NetQ8_1: Q8.1(G) Q11.3(C1) R76.2
NetQ9_2: Q9.2(B2) Q9.5(B1) Q9.6(C2) R71.2
NetQ10_2: Q10.2(B2) Q10.5(B1) Q10.6(C2) R73.2
NetQ11_2: Q11.2(B2) Q11.5(B1) Q11.6(C2) R75.2
NetR57_2: R57.2 USB1.A5(CC1)
NetR60_2: R60.2 USB2.A5(CC1)
NetR61_2: R61.2 USB1.B5(CC2)
NetR64_2: R64.2 USB2.B5(CC2)
NetR68_2: R68.2 USB3.A5(CC1)
NetR70_2: R70.2 USB3.B5(CC2)

Not connected (* = marked no-connect by the designer): IC6 7(NC.)* 8(~{OUT})* 9(~{CTS})* 10(~{DSR})* 11(~{RI})* 12(~{DCD})* 15(R232)*; USB1 A8(SBU1)* B8(SBU2)*; USB2 A8(SBU1)* B8(SBU2)*; USB3 A8(SBU1)* B8(SBU2)*

### Layout directives
net class USB: USB_N, USB_P
differential pair; net class DIFF90; differential pair class DIFF90: USB_N, USB_P

### Notes on the sheet
- MODBUS RTU MAX485
- FULL SPEED USB
- HIGH SPEED USB
- USB TTL

### Library data of the parts
C7 = CL10B102KB8NNNC: 50V 1nF X7R ±10% 0603 Ceramic Capacitors ROHS
C52-C55 C57 = CC0603KRX7R9BB104: as C3 on sheet Power
C56 = CL10A106MA8NRNC: as C1 on sheet Power
C58-C60 = CL10B105KA8NNNC: as C10 on sheet Power
D3-D9 D11-D13 = LESD5D5.0CT1G: as D2 on sheet interfaceUART&I2C
F4 F5 = 0603-010-24V: 24V 100mA 40A 300mA 900mΩ 0603 PTC Resettable Fuses RoHS
HD1 ZJP1 = 533980471: as CN2 on sheet interfaceUART&I2C
IC4 = MAX485ESA+T_C41365333: Transceiver 4.75V~5.25V SOIC-8 Drivers, Receivers, Transceivers RoHS
IC5 = TP74LVC1G132S5: 5ns@5V,50pF 10uA 1.65V~5.5V NAND Gate SOT-23-5 Gates and Inverters RoHS
IC6 = CH340C: Transceiver USB 2.0 SOP-16 Interface Controllers RoHS
Q3 = SS8550_C7420371: 300mW 25V 1.5A PNP SOT-23 Single Bipolar Transistors RoHS
Q4 Q5 = S8050_C2828466: 300mW 25V 500mA NPN SOT-23 Single Bipolar Transistors RoHS
Q6-Q8 = AO3407A: as Q1 on sheet interfaceUART&I2C
Q9-Q11 = LMBT3906DW1T1: 40V 150mW 200mA PNP SOT-363 Single Bipolar Transistors RoHS
R55 R63 R67 R69 R71 R73 R75 = RC0603FR-0710KL: as R2 on sheet Power
R56 R59 R62 = RC0603JR-070RL: as R5 on sheet Power
R57 R58 R60 R61 R64 R68 R70 = FRC0603F5101TS: as R21 on sheet MICROSD CARD
R65 R66 = RC0603FR-072K2L: 100mW 2.2kΩ 75V ±100ppm/℃ Thick Film Resistor ±1% 0603 Chip Resistor - Surface Mount RoHS
R72 R74 R76 = RC0603FR-07100KL_1RC0603FR-0751KL: 100mW 51kΩ 75V ±100ppm/℃ Thick Film Resistor ±1% 0603 Chip Resistor - Surface Mount RoHS
R80 = RC0603FR-071ML: 100mW 1MΩ 75V Thick Film Resistor ±100ppm/℃ ±1% 0603 Chip Resistor - Surface Mount RoHS
USB1-USB3 = GT-USB-7010ASV: USB 2.0 1 16P -40℃~+85℃ Type-C SMD USB, DVI, HDMI Connector Assemblies RoHS

## Sheet DSI&CSI CONNECTOR.SchDoc
size A4; SheetNumber: 9; SheetTotal: 9
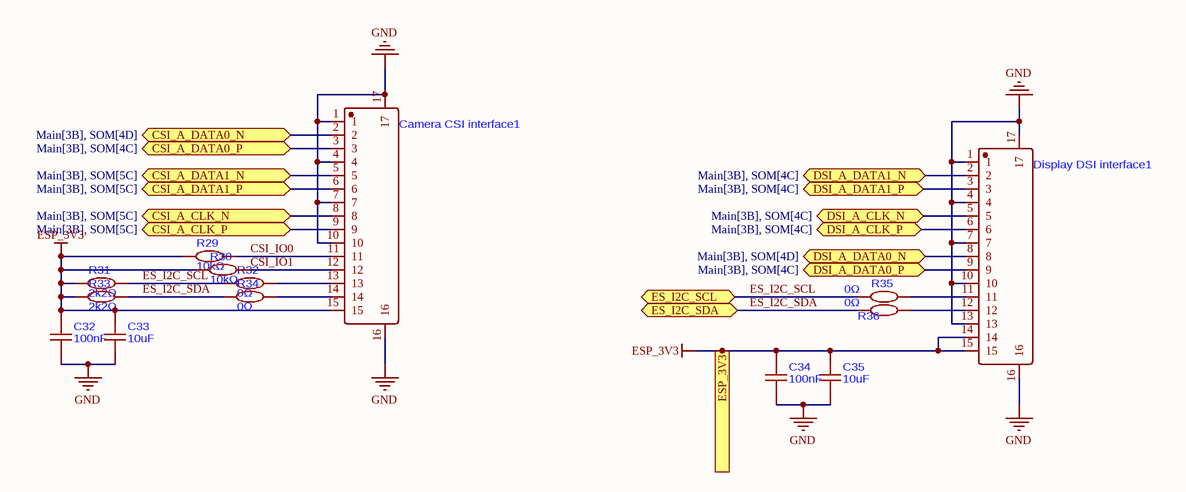
[diagram p6: DSI&CSI CONNECTOR.SchDoc]

### Parts
C32  100nF  [C0603]
C33  10uF  [C0603]
C34  100nF  [C0603]
C35  10uF  [C0603]
Camera_CSI_interface1  CONN FFC FPC 15POS 1mm BOTTOM CNT SMD R/A  [FPC-SMD_15P-P1.00_XUNPU_FPC-1.0FX-15PWCR-H20]  (value not drawn)
Display_DSI_interface1  CONN FFC FPC 15POS 1mm BOTTOM CNT SMD R/A  [FPC-SMD_15P-P1.00_XUNPU_FPC-1.0FX-15PWCR-H20]  (value not drawn)
R29  10kΩ  [R0603]
R30  10kΩ  [R0603]
R31  2k2Ω  [R0603]
R32  0Ω  [R0603]
R33  2k2Ω  [R0603]
R34  0Ω  [R0603]
R35  0Ω  [R0603]
R36  0Ω  [R0603]

### Ports
CSI_A_CLK_N (bidir, see Main[3B], SOM[5C]), CSI_A_CLK_P (bidir, see Main[3B], SOM[5C]), CSI_A_DATA0_N (bidir, see Main[3B], SOM[4D]), CSI_A_DATA0_P (bidir, see Main[3B], SOM[4C]), CSI_A_DATA1_N (bidir, see Main[3B], SOM[5C]), CSI_A_DATA1_P (bidir, see Main[3B], SOM[5C]), DSI_A_CLK_N (bidir, see Main[3B], SOM[4C]), DSI_A_CLK_P (bidir, see Main[3B], SOM[4C]), DSI_A_DATA0_N (bidir, see Main[3B], SOM[4D]), DSI_A_DATA0_P (bidir, see Main[3B], SOM[4C]), DSI_A_DATA1_N (bidir, see Main[3B], SOM[4C]), DSI_A_DATA1_P (bidir, see Main[3B], SOM[4C]), ES_I2C_SCL (bidir, see Main[4B], AUDIO CODEC[1B], interfaceUART&I2C[2C], SOM[6C]), ES_I2C_SDA (bidir, see Main[4B], AUDIO CODEC[1A], interfaceUART&I2C[2C], SOM[6C]), ESP_3V3 (in, see Main[4B], ETH-PHY[2A], interfaceUART&I2C[1C], Power[3C], SOM[6B])

### Nets
ESP_3V3: C32.2 C33.2 C34.2 C35.2 Camera_CSI_interface1.15 Display_DSI_interface1.14 Display_DSI_interface1.15 R29.1 R30.1 R31.1 R33.1 ; port ESP_3V3
GND: C32.1 C33.1 C34.1 C35.1 Camera_CSI_interface1.1 Camera_CSI_interface1.4 Camera_CSI_interface1.7 Camera_CSI_interface1.10 Camera_CSI_interface1.16 Camera_CSI_interface1.17 Display_DSI_interface1.1 Display_DSI_interface1.4 Display_DSI_interface1.7 Display_DSI_interface1.10 Display_DSI_interface1.13 Display_DSI_interface1.16 Display_DSI_interface1.17
CSI_A_CLK_N: Camera_CSI_interface1.8 ; port CSI_A_CLK_N
CSI_A_CLK_P: Camera_CSI_interface1.9 ; port CSI_A_CLK_P
CSI_A_DATA0_N: Camera_CSI_interface1.2 ; port CSI_A_DATA0_N
CSI_A_DATA0_P: Camera_CSI_interface1.3 ; port CSI_A_DATA0_P
CSI_A_DATA1_N: Camera_CSI_interface1.5 ; port CSI_A_DATA1_N
CSI_A_DATA1_P: Camera_CSI_interface1.6 ; port CSI_A_DATA1_P
CSI_IO0: Camera_CSI_interface1.11 R29.2
CSI_IO1: Camera_CSI_interface1.12 R30.2
DSI_A_CLK_N: Display_DSI_interface1.5 ; port DSI_A_CLK_N
DSI_A_CLK_P: Display_DSI_interface1.6 ; port DSI_A_CLK_P
DSI_A_DATA0_N: Display_DSI_interface1.8 ; port DSI_A_DATA0_N
DSI_A_DATA0_P: Display_DSI_interface1.9 ; port DSI_A_DATA0_P
DSI_A_DATA1_N: Display_DSI_interface1.2 ; port DSI_A_DATA1_N
DSI_A_DATA1_P: Display_DSI_interface1.3 ; port DSI_A_DATA1_P
ES_I2C_SCL: R31.2 R32.1 R35.1 ; port ES_I2C_SCL
ES_I2C_SDA: R33.2 R34.1 R36.1 ; port ES_I2C_SDA
NetCamera_CSI_interface1_13: Camera_CSI_interface1.13 R32.2
NetCamera_CSI_interface1_14: Camera_CSI_interface1.14 R34.2
NetDisplay_DSI_interface1_11: Display_DSI_interface1.11 R35.2
NetDisplay_DSI_interface1_12: Display_DSI_interface1.12 R36.2

### Library data of the parts
C32 C34 = CC0603KRX7R9BB104: as C3 on sheet Power
C33 C35 = CL10A106MA8NRNC: as C1 on sheet Power
Camera_CSI_interface1 Display_DSI_interface1 = FPC-1.0FX-15PWCR-H20: -25℃~+85℃ Hinged Lid 15P 1mm 500mA 50V Bottom Contact Surface Mount, Right Angle SMD,P=1mm,Surface Mount,Right Angle FFC, FPC (Flat Flexible) Connector Assemblies RoHS
R29 R30 = RC0603FR-0710KL: as R2 on sheet Power
R31 R33 = RC0603FR-072K2L: as R65 on sheet USB
R32 R34-R36 = RC0603JR-070RL: as R5 on sheet Power

## Sheet ETH-PHY.SchDoc
size A4; SheetNumber: 7; SheetTotal: 9
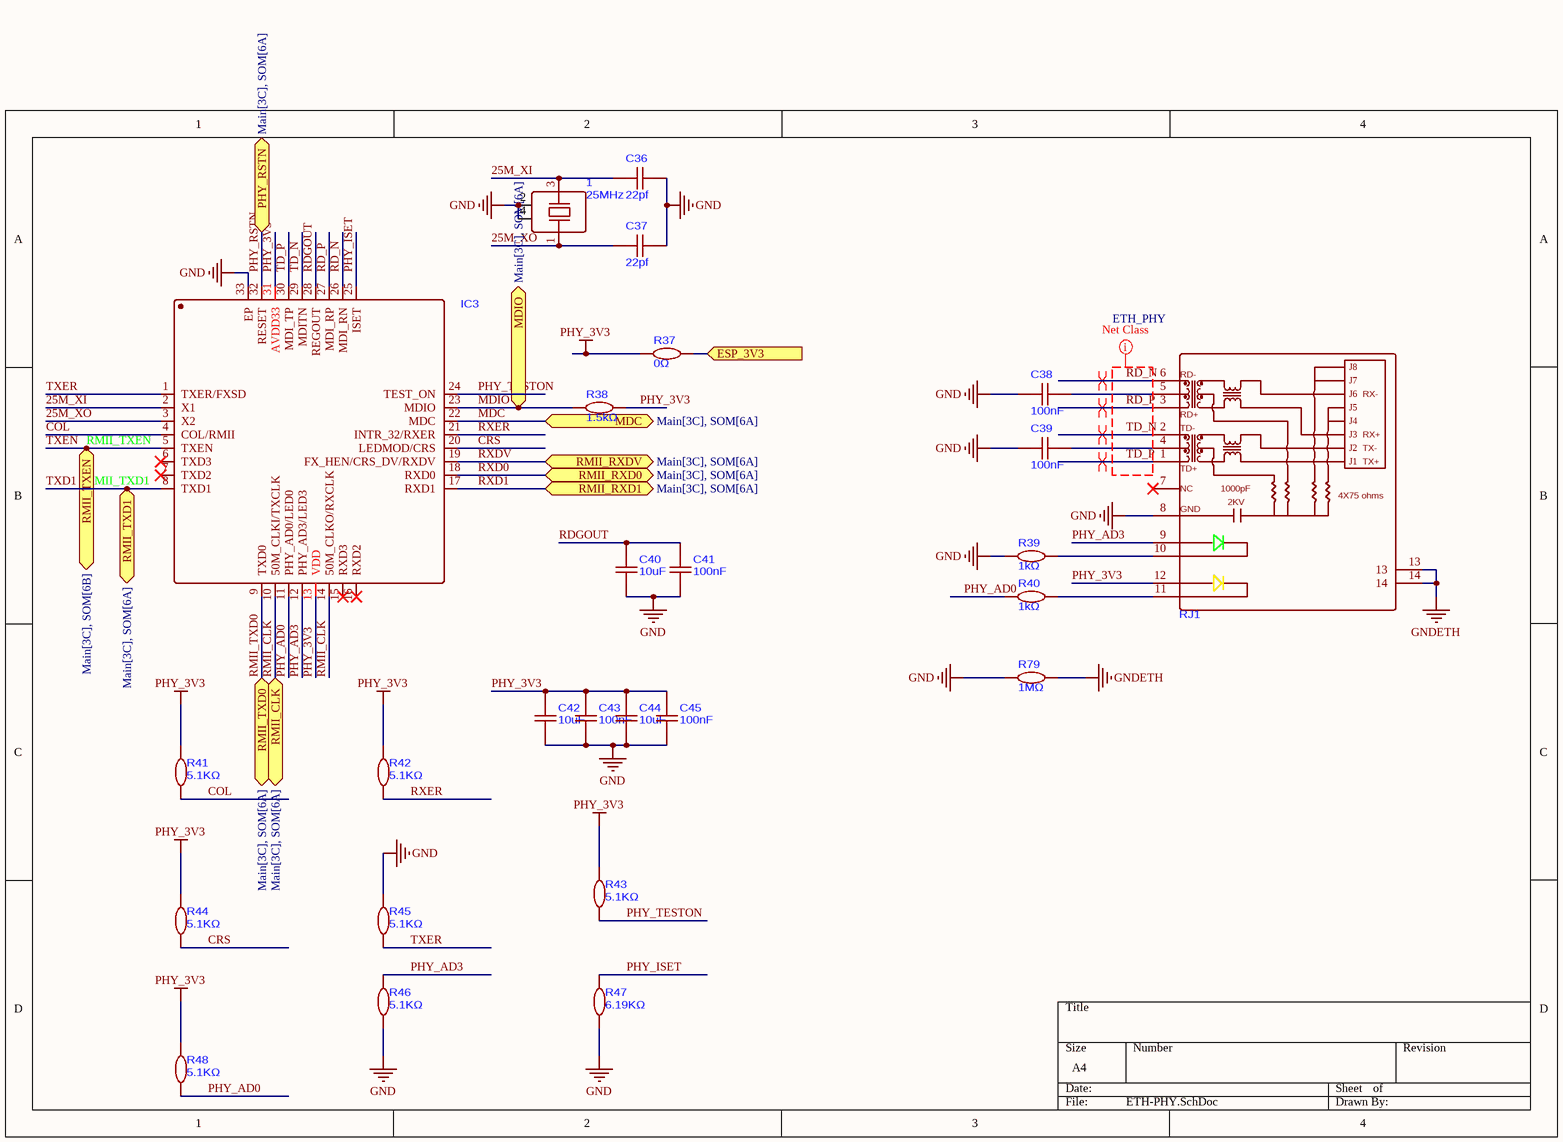
[diagram p7: ETH-PHY.SchDoc]

### Parts
1  25MHz  [CRYSTAL-SMD_4P-L3.2-W2.5-BL]
C36  22pf  [C0603]
C37  22pf  [C0603]
C38  100nF  [C0603]
C39  100nF  [C0603]
C40  10uF  [C0603]
C41  100nF  [C0603]
C42  10uF  [C0603]
C43  100nF  [C0603]
C44  10uF  [C0603]
C45  100nF  [C0603]
IC3  Single Port Fast Ethernet Transceiver  [QFN-32_L4.0-W4.0-P0.40-BL-EP2.7]  (value not drawn)
R37  0Ω  [R0603]
R38  1.5kΩ  [R0603]
R39  1kΩ  [R0603]
R40  1kΩ  [R0603]
R41  5.1KΩ  [R0603]
R42  5.1KΩ  [R0603]
R43  5.1KΩ  [R0603]
R44  5.1KΩ  [R0603]
R45  5.1KΩ  [R0603]
R46  5.1KΩ  [R0603]
R47  6.19KΩ  [R0603]
R48  5.1KΩ  [R0603]
R79  1MΩ  [R2010]
RJ1  CONN MOD JACK RJ45 TH  [RJ45-TH_HR913550A]  (value not drawn)

### Ports
ESP_3V3 (in, see Main[4C], DSI&CSI CONNECTOR[3C], interfaceUART&I2C[1C], Power[3C], SOM[6B]), MDC (bidir, see Main[3C], SOM[6A]), MDIO (bidir, see Main[3C], SOM[6A]), PHY_RSTN (bidir, see Main[3C], SOM[6A]), RMII_CLK (bidir, see Main[3C], SOM[6A]), RMII_RXD0 (bidir, see Main[3C], SOM[6A]), RMII_RXD1 (bidir, see Main[3C], SOM[6A]), RMII_RXDV (bidir, see Main[3C], SOM[6A]), RMII_TXD0 (bidir, see Main[3C], SOM[6A]), RMII_TXD1 (bidir, see Main[3C], SOM[6A]), RMII_TXEN (bidir, see Main[3C], SOM[6B])

### Nets
ESP_3V3: R37.2 ; port ESP_3V3
GND: 1.2(GND) 1.4(GND) C36.2 C37.2 C38.1 C39.1 C40.1 C41.1 C42.1 C43.1 C44.1 C45.1 IC3.33(EP) R39.1 R45.2 R46.2 R47.1 R79.1 RJ1.8(GND)
GNDETH: R79.2 RJ1.13 RJ1.14
PHY_3V3: C42.2 C43.2 C44.2 C45.2 IC3.13(VDD) IC3.31(AVDD33) R37.1 R38.2 R41.2 R42.2 R43.2 R44.2 R48.2 RJ1.12
25M_XI: 1.3(OSC2) C36.1 IC3.2(X1)
25M_XO: 1.1(OSC1) C37.1 IC3.3(X2)
COL: IC3.4(COL/RMII) R41.1
CRS: IC3.20(LEDMOD/CRS) R44.1
MDC: IC3.22(MDC) ; port MDC  [project net GPIO31]
MDIO: IC3.23(MDIO) R38.1 ; port MDIO  [project net GPIO52]
PHY_AD0: IC3.11(PHY_AD0/LED0) R40.1 R48.1
PHY_AD3: IC3.12(PHY_AD3/LED3) R46.1 RJ1.9
PHY_ISET: IC3.25(ISET) R47.2
PHY_RSTN: IC3.32(RESET) ; port PHY_RSTN  [project net GPIO51]
PHY_TESTON: IC3.24(TEST_ON) R43.1
RD_N: IC3.26(MDI_RN) RJ1.6
RD_P: IC3.27(MDI_RP) RJ1.3
RDGOUT: C40.2 C41.2 IC3.28(REGOUT)
RMII_CLK: IC3.10(50M_CLKI/TXCLK) IC3.14(50M_CLKO/RXCLK) ; port RMII_CLK  [project net GPIO50]
RMII_TXD0: IC3.9(TXD0) ; port RMII_TXD0  [project net GPIO34]
RMII_TXD1: IC3.8(TXD1) ; port RMII_TXD1  [also labelled TXD1]
RMII_TXEN: IC3.5(TXEN) ; port RMII_TXEN  [also labelled TXEN]
RXD0: IC3.18(RXD0) ; port RMII_RXD0  [project net GPIO29]
RXD1: IC3.17(RXD1) ; port RMII_RXD1  [project net GPIO30]
RXDV: IC3.19(FX_HEN/CRS_DV/RXDV) ; port RMII_RXDV  [project net GPIO28]
RXER: IC3.21(INTR_32/RXER) R42.1
TD_N: IC3.29(MDITN) RJ1.2
TD_P: IC3.30(MDI_TP) RJ1.1
TXER: IC3.1(TXER/FXSD) R45.1
NetC38_2: C38.2 RJ1.5
NetC39_2: C39.2 RJ1.4
NetR39_2: R39.2 RJ1.10
NetR40_2: R40.2 RJ1.11

Not connected (* = marked no-connect by the designer): IC3 6(TXD3)* 7(TXD2)* 15(RXD3)* 16(RXD2)*; RJ1 7(NC)*

### Layout directives
net class ETH_PHY: RD_N, RD_P, TD_N, TD_P
differential pair; net class DIFF100; differential pair class DIFF100: RD_N, RD_P, TD_N, TD_P

### Notes on the sheet
- (in symbol HR913550A) J8; RD-; J7; J6; RX-; J5; RD+; J4; TD-; J3; RX+; J2; TX-; J1; TX+; TD+; 1000pF; 4X75 ohms; 2KV

### Library data of the parts
1 = X322525MOB4SI
C36 C37 = CL10C220JB8NNNC: as C2 on sheet Power
C38 C39 C41 C43 C45 = CC0603KRX7R9BB104: as C3 on sheet Power
C40 C42 C44 = CL10A106MA8NRNC: as C1 on sheet Power
IC3 = IP101GRI: Ethernet Transceiver 3.3V QFN-32-EP(4x4) Drivers, Receivers, Transceivers RoHS
R37 = RC0603JR-070RL: as R5 on sheet Power
R38 = RC0603FR-071K5L: 100mW 1.5kΩ 75V ±100ppm/℃ Thick Film Resistor ±1% 0603 Chip Resistor - Surface Mount RoHS
R39 R40 = RMC 0603 1K J N: as R1 on sheet Power
R41-R46 R48 = FRC0603F5101TS: as R21 on sheet MICROSD CARD
R47 = AC0603FR-076K19L: 6.19kΩ 100mW 75V ±100ppm/℃ Thick Film Resistor ±1% 0603 Chip Resistor - Surface Mount RoHS
R79 = RC0603FR-071ML: as R80 on sheet USB
RJ1 = HR913550A: 1 With LED Through Hole Modular/Ethernet Connector Jacks With Magnetics RoHS

## Sheet SOM.SchDoc
size A3; SheetNumber: 8; SheetTotal: 9
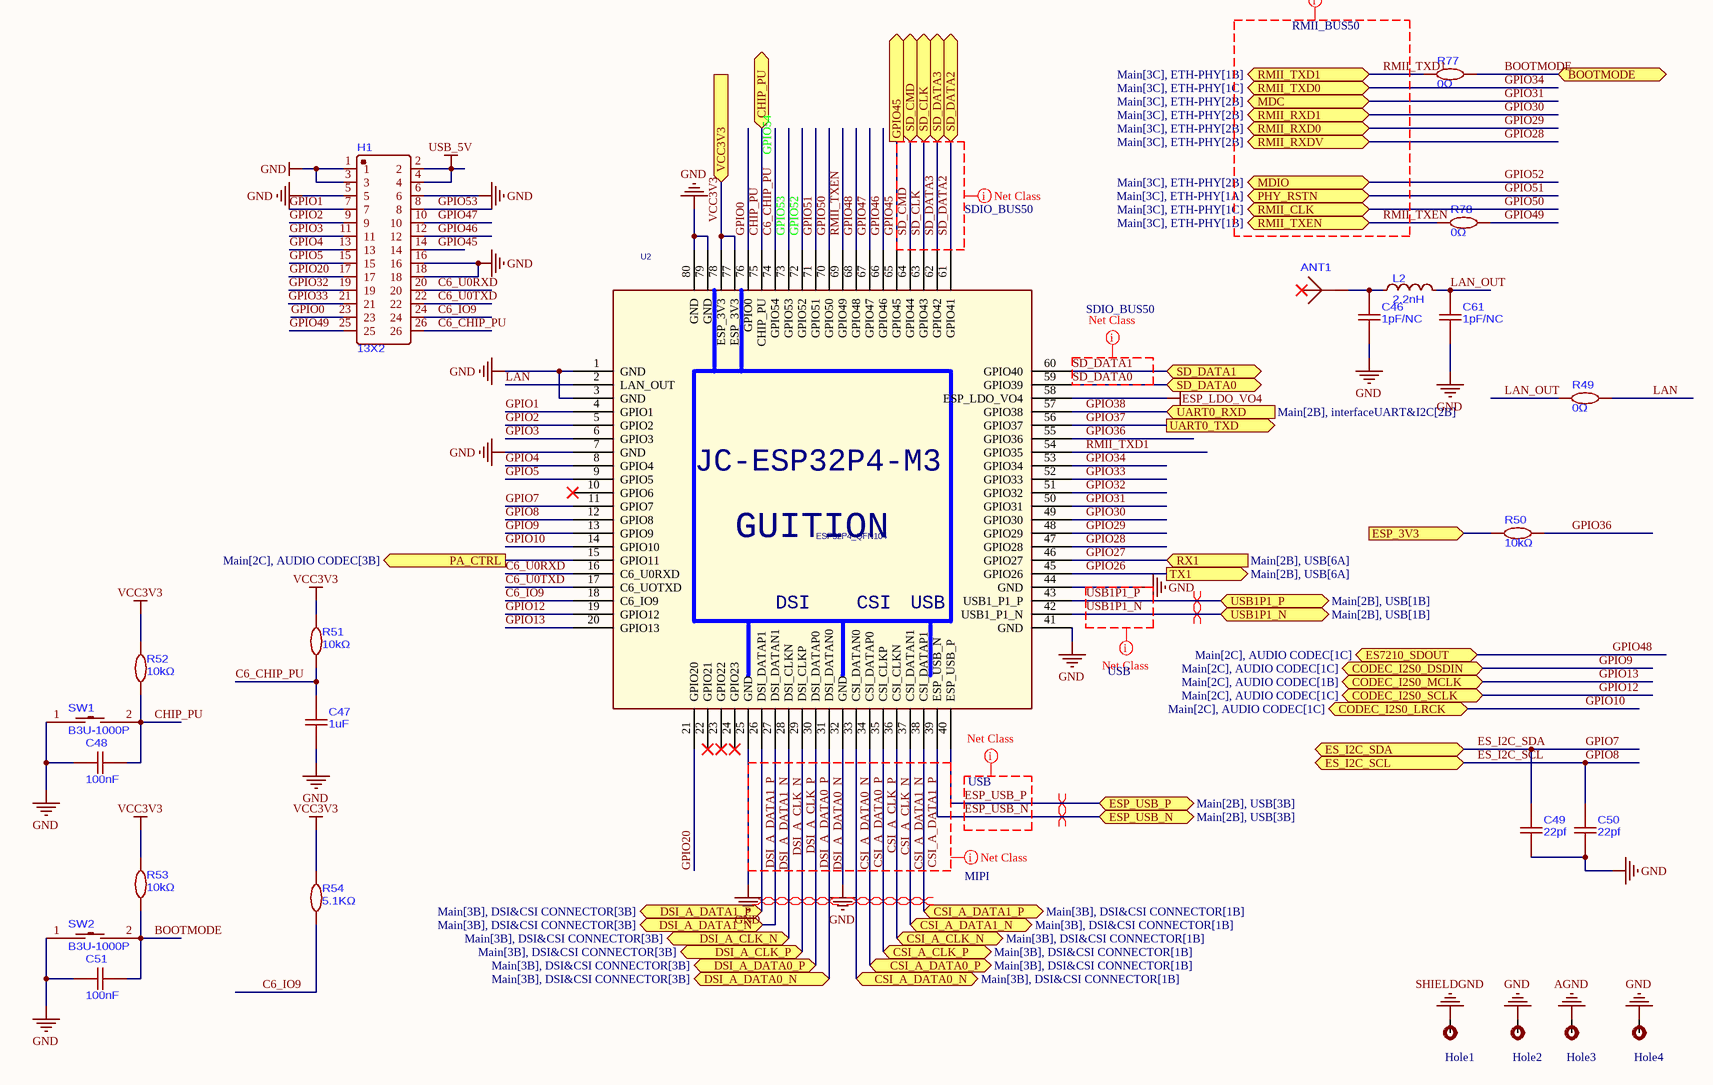
[diagram p8: SOM.SchDoc]

### Parts
ANT1  RF ANT 2450MHz CERAMIC SMD  [ANT-SMD-2_L3.2-W1.6-C504002]  (value not drawn)
C46  1pF/NC  [C0402]
C47  1uF  [C0603]
C48  100nF  [C0603]
C49  22pf  [C0603]
C50  22pf  [C0603]
C51  100nF  [C0603]
C61  1pF/NC  [C0402]
H1  13X2  [HDR-TH_26P-P2.54-V-M-R2-C13-S2.54]
Hole1  Pad Big  [Screw 3.0]  (value not drawn)
Hole2  Pad Big  [Screw 3.0]  (value not drawn)
Hole3  Pad Big  [Screw 3.0]  (value not drawn)
Hole4  Pad Big  [Screw 3.0]  (value not drawn)
L2  2.2nH  [C0402]
R49  0Ω  [R0402]
R50  10kΩ  [R0603]
R51  10kΩ  [R0603]
R52  10kΩ  [R0603]
R53  10kΩ  [R0603]
R54  5.1KΩ  [R0603]
R77  0Ω  [R0402]
R78  0Ω  [R0402]
SW1  B3U-1000P  [KEY-SMD_B3U-1000PM]
SW2  B3U-1000P  [KEY-SMD_B3U-1000PM]
U2  ESP32P4_QFN104  [JC-ESP32P4-M3_V0.2]

### Ports
BOOTMODE (bidir, see Main[2B], USB[5C]), CHIP_PU (bidir, see Main[2B], USB[4C]), CODEC_I2S0_DSDIN (bidir, see Main[2C], AUDIO CODEC[1C]), CODEC_I2S0_LRCK (bidir, see Main[2C], AUDIO CODEC[1C]), CODEC_I2S0_MCLK (bidir, see Main[2C], AUDIO CODEC[1B]), CODEC_I2S0_SCLK (bidir, see Main[2C], AUDIO CODEC[1C]), CSI_A_CLK_N (bidir, see Main[3B], DSI&CSI CONNECTOR[1B]), CSI_A_CLK_P (bidir, see Main[3B], DSI&CSI CONNECTOR[1B]), CSI_A_DATA0_N (bidir, see Main[3B], DSI&CSI CONNECTOR[1B]), CSI_A_DATA0_P (bidir, see Main[3B], DSI&CSI CONNECTOR[1B]), CSI_A_DATA1_N (bidir, see Main[3B], DSI&CSI CONNECTOR[1B]), CSI_A_DATA1_P (bidir, see Main[3B], DSI&CSI CONNECTOR[1B]), DSI_A_CLK_N (bidir, see Main[3B], DSI&CSI CONNECTOR[3B]), DSI_A_CLK_P (bidir, see Main[3B], DSI&CSI CONNECTOR[3B]), DSI_A_DATA0_N (bidir, see Main[3B], DSI&CSI CONNECTOR[3B]), DSI_A_DATA0_P (bidir, see Main[3B], DSI&CSI CONNECTOR[3B]), DSI_A_DATA1_N (bidir, see Main[3B], DSI&CSI CONNECTOR[3B]), DSI_A_DATA1_P (bidir, see Main[3B], DSI&CSI CONNECTOR[3B]), ES7210_SDOUT (bidir, see Main[2C], AUDIO CODEC[1C]), ES_I2C_SCL (bidir, see Main[2B], AUDIO CODEC[1B], DSI&CSI CONNECTOR[2C], interfaceUART&I2C[2C]), ES_I2C_SDA (bidir, see Main[2B], AUDIO CODEC[1A], DSI&CSI CONNECTOR[2C], interfaceUART&I2C[2C]), ESP_3V3 (in, see Main[2A], DSI&CSI CONNECTOR[3C], ETH-PHY[2A], interfaceUART&I2C[1C], Power[3C]), ESP_USB_N (bidir, see Main[2B], USB[3B]), ESP_USB_P (bidir, see Main[2B], USB[3B]), GPIO45 (out, see Main[3A], MICROSD CARD[1B]), MDC (bidir, see Main[3C], ETH-PHY[2B]), MDIO (bidir, see Main[3C], ETH-PHY[2B]), PA_CTRL (out, see Main[2C], AUDIO CODEC[3B]), PHY_RSTN (bidir, see Main[3C], ETH-PHY[1A]), RMII_CLK (bidir, see Main[3C], ETH-PHY[1C]), RMII_RXD0 (bidir, see Main[3C], ETH-PHY[2B]), RMII_RXD1 (bidir, see Main[3C], ETH-PHY[2B]), RMII_RXDV (bidir, see Main[3C], ETH-PHY[2B]), RMII_TXD0 (bidir, see Main[3C], ETH-PHY[1C]), RMII_TXD1 (bidir, see Main[3C], ETH-PHY[1B]), RMII_TXEN (bidir, see Main[3C], ETH-PHY[1B]), RX1 (in, see Main[2B], USB[6A]), SD_CLK (bidir, see Main[3A], MICROSD CARD[2B]), SD_CMD (bidir, see Main[3A], MICROSD CARD[2B]), SD_DATA0 (bidir, see Main[3A], MICROSD CARD[2C]), SD_DATA1 (bidir, see Main[3A], MICROSD CARD[2C]), SD_DATA2 (bidir, see Main[3A], MICROSD CARD[2B]), SD_DATA3 (bidir, see Main[3A], MICROSD CARD[2B]), TX1 (out, see Main[2B], USB[6A]), UART0_RXD (in, see Main[2B], interfaceUART&I2C[2B]), UART0_TXD (out, see Main[2B], interfaceUART&I2C[1B], USB[2C]), USB1P1_N (bidir, see Main[2B], USB[1B]), USB1P1_P (bidir, see Main[2B], USB[1B]), VCC3V3 (in, see Main[2A], Power[2B], USB[4C])

### Nets
AGND: Hole3.1
ESP_3V3: R50.1 ; port ESP_3V3
ESP_LDO_VO4: U2.58(ESP_LDO_VO4)
GND: C46.1 C47.1 C48.2 C49.1 C50.1 C51.2 C61.1 H1.1 H1.3 H1.5 H1.6 H1.16 H1.18 Hole2.1 Hole4.1 SW1.1 SW2.1 U2.1(GND) U2.3(GND) U2.7(GND) U2.25(GND) U2.32(GND) U2.41(GND) U2.44(GND) U2.79(GND) U2.80(GND)
SHIELDGND: Hole1.1
USB_5V: H1.2 H1.4
VCC3V3: R51.2 R52.2 R53.2 R54.2 U2.77(ESP_3V3) U2.78(ESP_3V3) ; port VCC3V3
BOOTMODE: C51.1 R53.1 R77.2 SW2.2 ; port BOOTMODE
C6_CHIP_PU: C47.2 H1.26 R51.1 U2.74(GPIO54)  [also labelled GPIO54]
C6_IO9: H1.24 R54.1 U2.18(C6_IO9)
C6_U0RXD: H1.20 U2.16(C6_U0RXD)
C6_U0TXD: H1.22 U2.17(C6_UOTXD)
CHIP_PU: C48.1 R52.1 SW1.2 U2.75(CHIP_PU) ; port CHIP_PU
CSI_A_CLK_N: U2.36(CSI_CLKN) ; port CSI_A_CLK_N
CSI_A_CLK_P: U2.35(CSI_CLKP) ; port CSI_A_CLK_P
CSI_A_DATA0_N: U2.33(CSI_DATAN0) ; port CSI_A_DATA0_N
CSI_A_DATA0_P: U2.34(CSI_DATAP0) ; port CSI_A_DATA0_P
CSI_A_DATA1_N: U2.37(CSI_DATAN1) ; port CSI_A_DATA1_N
CSI_A_DATA1_P: U2.38(CSI_DATAP1) ; port CSI_A_DATA1_P
DSI_A_CLK_N: U2.28(DSI_CLKN) ; port DSI_A_CLK_N
DSI_A_CLK_P: U2.29(DSI_CLKP) ; port DSI_A_CLK_P
DSI_A_DATA0_N: U2.31(DSI_DATAN0) ; port DSI_A_DATA0_N
DSI_A_DATA0_P: U2.30(DSI_DATAP0) ; port DSI_A_DATA0_P
DSI_A_DATA1_N: U2.27(DSI_DATAN1) ; port DSI_A_DATA1_N
DSI_A_DATA1_P: U2.26(DSI_DATAP1) ; port DSI_A_DATA1_P
ES_I2C_SCL: C50.2 U2.12(GPIO8) ; port ES_I2C_SCL  [also labelled GPIO8]
ES_I2C_SDA: C49.2 U2.11(GPIO7) ; port ES_I2C_SDA  [also labelled GPIO7]
ESP_USB_N: U2.39(ESP_USB_N) ; port ESP_USB_N
ESP_USB_P: U2.40(ESP_USB_P) ; port ESP_USB_P
GPIO0: H1.23 U2.76(GPIO0)
GPIO1: H1.7 U2.4(GPIO1)
GPIO2: H1.9 U2.5(GPIO2)
GPIO3: H1.11 U2.6(GPIO3)
GPIO4: H1.13 U2.8(GPIO4)
GPIO5: H1.15 U2.9(GPIO5)
GPIO9: U2.13(GPIO9) ; port CODEC_I2S0_DSDIN  [project net CODEC_I2S0_DSDIN]
GPIO10: U2.14(GPIO10) ; port CODEC_I2S0_LRCK  [project net CODEC_I2S0_LRCK]
GPIO12: U2.19(GPIO12) ; port CODEC_I2S0_SCLK  [project net CODEC_I2S0_SCLK]
GPIO13: U2.20(GPIO13) ; port CODEC_I2S0_MCLK  [project net CODEC_I2S0_MCLK]
GPIO20: H1.17 U2.21(GPIO20)
GPIO26: U2.45(GPIO26) ; port TX1
GPIO27: U2.46(GPIO27) ; port RX1
GPIO28: U2.47(GPIO28) ; port RMII_RXDV
GPIO29: U2.48(GPIO29) ; port RMII_RXD0
GPIO30: U2.49(GPIO30) ; port RMII_RXD1
GPIO31: U2.50(GPIO31) ; port MDC
GPIO32: H1.19 U2.51(GPIO32)
GPIO33: H1.21 U2.52(GPIO33)
GPIO34: U2.53(GPIO34) ; port RMII_TXD0
GPIO36: R50.2 U2.55(GPIO36)
GPIO37: U2.56(GPIO37) ; port UART0_TXD
GPIO38: U2.57(GPIO38) ; port UART0_RXD
GPIO45: H1.14 U2.65(GPIO45) ; port GPIO45
GPIO46: H1.12 U2.66(GPIO46)
GPIO47: H1.10 U2.67(GPIO47)
GPIO48: U2.68(GPIO48) ; port ES7210_SDOUT  [project net ES7210_SDOUT]
GPIO49: H1.25 R78.2
GPIO50: U2.70(GPIO50) ; port RMII_CLK
GPIO51: U2.71(GPIO51) ; port PHY_RSTN
GPIO52: U2.72(GPIO52) ; port MDIO
GPIO53: H1.8 U2.73(GPIO53)
LAN: R49.2 U2.2(LAN_OUT)
LAN_OUT: C61.2 L2.2 R49.1
RMII_TXD1: R77.1 U2.54(GPIO35) ; port RMII_TXD1
RMII_TXEN: R78.1 U2.69(GPIO49) ; port RMII_TXEN
SD_CLK: U2.63(GPIO43) ; port SD_CLK
SD_CMD: U2.64(GPIO44) ; port SD_CMD
SD_DATA0: U2.59(GPIO39) ; port SD_DATA0
SD_DATA1: U2.60(GPIO40) ; port SD_DATA1
SD_DATA2: U2.61(GPIO41) ; port SD_DATA2
SD_DATA3: U2.62(GPIO42) ; port SD_DATA3
USB1P1_N: U2.42(USB1_P1_N) ; port USB1P1_N
USB1P1_P: U2.43(USB1_P1_P) ; port USB1P1_P
NetANT1_2: ANT1.2 C46.2 L2.1
NetIC2_1: U2.15(GPIO11) ; port PA_CTRL

Not connected (* = marked no-connect by the designer): ANT1 1(ANT)*; U2 10(GPIO6)* 22(GPIO21)* 23(GPIO22)* 24(GPIO23)*

### Layout directives
net class USB: ESP_USB_N, ESP_USB_P, GND, USB1P1_N, USB1P1_P
differential pair; net class DIFF90; differential pair class DIFF90: ESP_USB_N, ESP_USB_P, USB1P1_N, USB1P1_P
net class MIPI: CSI_A_CLK_N, CSI_A_CLK_P, CSI_A_DATA0_N, CSI_A_DATA0_P, CSI_A_DATA1_N, CSI_A_DATA1_P, DSI_A_CLK_N, DSI_A_CLK_P, DSI_A_DATA0_N, DSI_A_DATA0_P, DSI_A_DATA1_N, DSI_A_DATA1_P
differential pair; net class DIFF100; differential pair class DIFF100: CSI_A_CLK_N, CSI_A_CLK_P, CSI_A_DATA0_N, CSI_A_DATA0_P, CSI_A_DATA1_N, CSI_A_DATA1_P, DSI_A_CLK_N, DSI_A_CLK_P, DSI_A_DATA0_N, DSI_A_DATA0_P, DSI_A_DATA1_N, DSI_A_DATA1_P
net class SDIO_BUS50: GPIO45, SD_CLK, SD_CMD, SD_DATA0, SD_DATA1, SD_DATA2, SD_DATA3
net class RMII_BUS50: RMII_TXD1, RMII_TXEN

### Notes on the sheet
- (in symbol JC-ESP32P4-M3) GUITION; DSI; CSI; USB

### Library data of the parts
ANT1 = kinghelm KH-3216-A35: Ceramic Antenna 5.19dBi 100MHz 2.45GHz 1206 RF Antennas RoHS
C46 C61 = FCC0603N1R0C500CT: 50V 1pF C0G 0603 Ceramic Capacitors RoHS
C47 = CL10B105KA8NNNC: as C10 on sheet Power
C48 C51 = CC0603KRX7R9BB104: as C3 on sheet Power
C49 C50 = CL10C220JB8NNNC: as C2 on sheet Power
H1 = HX PZ2.54-2X13P ZZ: 26P 2x13P Gold Copper Alloy -40℃~+105℃ Pin Header Black 2.54mm 2.5mm 6mm 1kV 3mm 3A 2 Through Hole 2.54mm Through Hole,P=2.54mm Headers, Male Pins RoHS
Hole1-Hole4 = Pad_Big: Value: Pad Big - Hole
L2 = MQG06HF2N2JT7: 700mA 2.2nH ±5% Wirewound Chip Inductor 80mΩ 0603 Fixed Inductors RoHS
R49 R77 R78 = RC0603JR-070RL: as R5 on sheet Power
R50-R53 = RC0603FR-0710KL: as R2 on sheet Power
R54 = FRC0603F5101TS: as R21 on sheet MICROSD CARD
SW1 SW2 = B3U-1000P: 12V 2.5mm Round Button 3mm SPST 50mA SMD,3x2.5mm Tactile Switches ROHS
U2 = JC-ESP32P4-M3

## Nets that join several sheets
AGND: Power (5 pins), AUDIO CODEC (25 pins), SOM (Hole3.1)
ESP_3V3: Power (R5.2), interfaceUART&I2C (CN3.3), DSI&CSI CONNECTOR (11 pins), ETH-PHY (R37.2), SOM (R50.1)
ESP_LDO_VO4: MICROSD CARD (R20.1 R23.1), SOM (U2.58)
GND: Power (10 pins), interfaceUART&I2C (9 pins), MICROSD CARD (8 pins), USB (46 pins), DSI&CSI CONNECTOR (17 pins), ETH-PHY (19 pins), SOM (26 pins)
SHIELDGND: USB (14 pins), SOM (Hole1.1)
USB_5V: Power (8 pins), interfaceUART&I2C (D2.2 Q1.2), USB (15 pins), SOM (H1.2 H1.4)
VCC3V3: Power (6 pins), USB (5 pins), SOM (6 pins)
VDDA: Power (C1.2 C3.2 F1.2 R1.2), AUDIO CODEC (R16.1)
BOOTMODE: USB (Q4.3), SOM (C51.1 R53.1 R77.2 SW2.2)
CHIP_PU: USB (Q5.3), SOM (C48.1 R52.1 SW1.2 U2.75)
CODEC_I2S0_DSDIN: AUDIO CODEC (IC1.9), SOM (U2.13)
CODEC_I2S0_LRCK: AUDIO CODEC (IC1.8), SOM (U2.14)
CODEC_I2S0_MCLK: AUDIO CODEC (IC1.2), SOM (U2.20)
CODEC_I2S0_SCLK: AUDIO CODEC (IC1.6), SOM (U2.19)
CSI_A_CLK_N: DSI&CSI CONNECTOR (Camera_CSI_interface1.8), SOM (U2.36)
CSI_A_CLK_P: DSI&CSI CONNECTOR (Camera_CSI_interface1.9), SOM (U2.35)
CSI_A_DATA0_N: DSI&CSI CONNECTOR (Camera_CSI_interface1.2), SOM (U2.33)
CSI_A_DATA0_P: DSI&CSI CONNECTOR (Camera_CSI_interface1.3), SOM (U2.34)
CSI_A_DATA1_N: DSI&CSI CONNECTOR (Camera_CSI_interface1.5), SOM (U2.37)
CSI_A_DATA1_P: DSI&CSI CONNECTOR (Camera_CSI_interface1.6), SOM (U2.38)
DSI_A_CLK_N: DSI&CSI CONNECTOR (Display_DSI_interface1.5), SOM (U2.28)
DSI_A_CLK_P: DSI&CSI CONNECTOR (Display_DSI_interface1.6), SOM (U2.29)
DSI_A_DATA0_N: DSI&CSI CONNECTOR (Display_DSI_interface1.8), SOM (U2.31)
DSI_A_DATA0_P: DSI&CSI CONNECTOR (Display_DSI_interface1.9), SOM (U2.30)
DSI_A_DATA1_N: DSI&CSI CONNECTOR (Display_DSI_interface1.2), SOM (U2.27)
DSI_A_DATA1_P: DSI&CSI CONNECTOR (Display_DSI_interface1.3), SOM (U2.26)
ES7210_SDOUT: AUDIO CODEC (IC1.7), SOM (U2.68)
ES_I2C_SCL: interfaceUART&I2C (CN3.2), AUDIO CODEC (R10.1), DSI&CSI CONNECTOR (R31.2 R32.1 R35.1), SOM (C50.2 U2.12)
ES_I2C_SDA: interfaceUART&I2C (CN3.1), AUDIO CODEC (IC1.19), DSI&CSI CONNECTOR (R33.2 R34.1 R36.1), SOM (C49.2 U2.11)
ESP_USB_N: USB (D6.1 USB1.A7 USB1.B7), SOM (U2.39)
ESP_USB_P: USB (D5.1 USB1.A6 USB1.B6), SOM (U2.40)
GPIO26: USB (R59.1 R62.1 ZJP1.2), SOM (U2.45)
GPIO27: USB (R56.1 ZJP1.3), SOM (U2.46)
GPIO28: ETH-PHY (IC3.19), SOM (U2.47)
GPIO29: ETH-PHY (IC3.18), SOM (U2.48)
GPIO30: ETH-PHY (IC3.17), SOM (U2.49)
GPIO31: ETH-PHY (IC3.22), SOM (U2.50)
GPIO34: ETH-PHY (IC3.9), SOM (U2.53)
GPIO37: interfaceUART&I2C (R17.2), USB (IC6.3), SOM (U2.56)
GPIO38: interfaceUART&I2C (D1.3 R19.2), SOM (U2.57)
GPIO45: MICROSD CARD (Q2.1 R26.2), SOM (H1.14 U2.65)
GPIO50: ETH-PHY (IC3.10 IC3.14), SOM (U2.70)
GPIO51: ETH-PHY (IC3.32), SOM (U2.71)
GPIO52: ETH-PHY (IC3.23 R38.1), SOM (U2.72)
NetIC2_1: AUDIO CODEC (IC2.1 R13.2), SOM (U2.15)
RMII_TXD1: ETH-PHY (IC3.8), SOM (R77.1 U2.54)
RMII_TXEN: ETH-PHY (IC3.5), SOM (R78.1 U2.69)
SD_CLK: MICROSD CARD (R25.2 TF1.5), SOM (U2.63)
SD_CMD: MICROSD CARD (R24.2 TF1.3), SOM (U2.64)
SD_DATA0: MICROSD CARD (R27.2 TF1.7), SOM (U2.59)
SD_DATA1: MICROSD CARD (R28.2 TF1.8), SOM (U2.60)
SD_DATA2: MICROSD CARD (R21.2 TF1.1), SOM (U2.61)
SD_DATA3: MICROSD CARD (R22.2 TF1.2), SOM (U2.62)
U0_RX1: interfaceUART&I2C (D1.2), USB (IC6.2)
USB1P1_N: USB (D8.1 USB2.A7 USB2.B7), SOM (U2.42)
USB1P1_P: USB (D9.1 USB2.A6 USB2.B6), SOM (U2.43)
VCC5VA: Power (C10.1 C11.2 F3.2), AUDIO CODEC (C25.2 IC2.6)